# EAGLE schematic PROJECT_V2 (EAGLE 8.7.0)
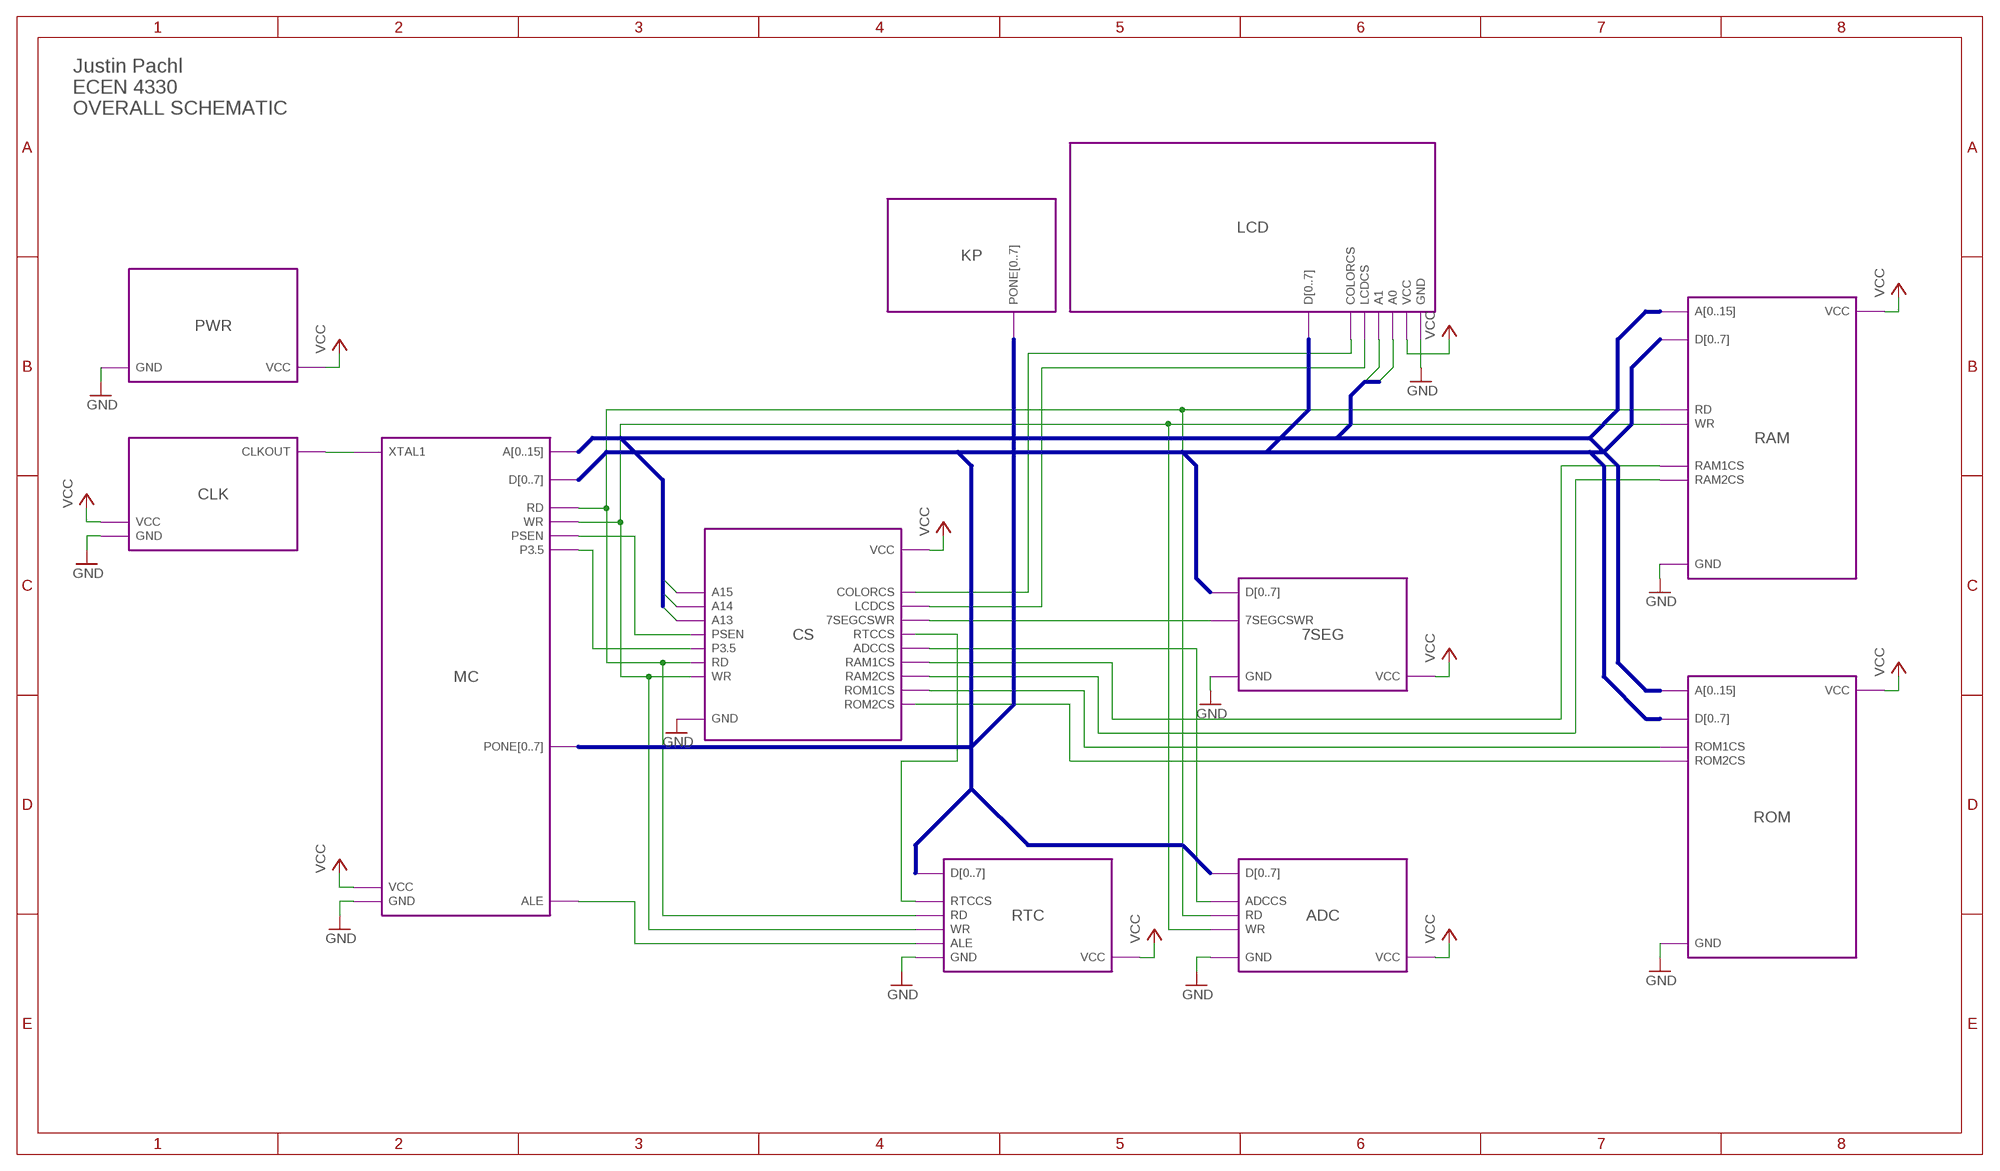
[diagram p0: schematic, sheet 1]

## Module instances
CLK = CLOCK
ROM = ROM
RAM = RAM
7SEG = 7SEG
PWR = POWERSP
LCD = LCD
RTC = RTC
ADC = ADC
MC = MICROCONTROLLER
CS = CHIPSELECT
KP = KEYPAD

## Nets
7SEGCSWR: port 7SEG.7SEGCSWR CS.7SEGCSWR
A0: port LCD.A0
A1: port LCD.A1
A13: port CS.A13
A14: port CS.A14
A15: port CS.A15
ADCCS: port CS.ADCCS ADC.ADCCS
ALE: port RTC.ALE MC.ALE
CLKSIG: port CLK.CLKOUT MC.XTAL1
COLORCS: port LCD.COLORCS CS.COLORCS
GND: port LCD.GND ROM.GND ADC.GND RTC.GND MC.GND CLK.GND PWR.GND 7SEG.GND RAM.GND CS.GND
LCDCS: port CS.LCDCS LCD.LCDCS
P3.5: port MC.P3.5 CS.P3.5
PSEN: port MC.PSEN CS.PSEN
RAM1CS: port CS.RAM1CS RAM.RAM1CS
RAM2CS: port CS.RAM2CS RAM.RAM2CS
RD: port MC.RD CS.RD RAM.RD ADC.RD RTC.RD
ROM1CS: port ROM.ROM1CS CS.ROM1CS
ROM2CS: port ROM.ROM2CS CS.ROM2CS
RTCCS: port RTC.RTCCS CS.RTCCS
VCC: port PWR.VCC RTC.VCC ADC.VCC ROM.VCC RAM.VCC LCD.VCC 7SEG.VCC MC.VCC CLK.VCC CS.VCC
WR: port MC.WR CS.WR RAM.WR ADC.WR RTC.WR

## Buses
A[0..15]
D[0..7]
PONE[0..7]

## Notes on the sheet
- Justin Pachl
  ECEN 4330
  OVERALL SCHEMATIC

## Library data of the parts

## Module CLOCK
Ports: GND(pwr) VCC(pwr) CLKOUT(io)
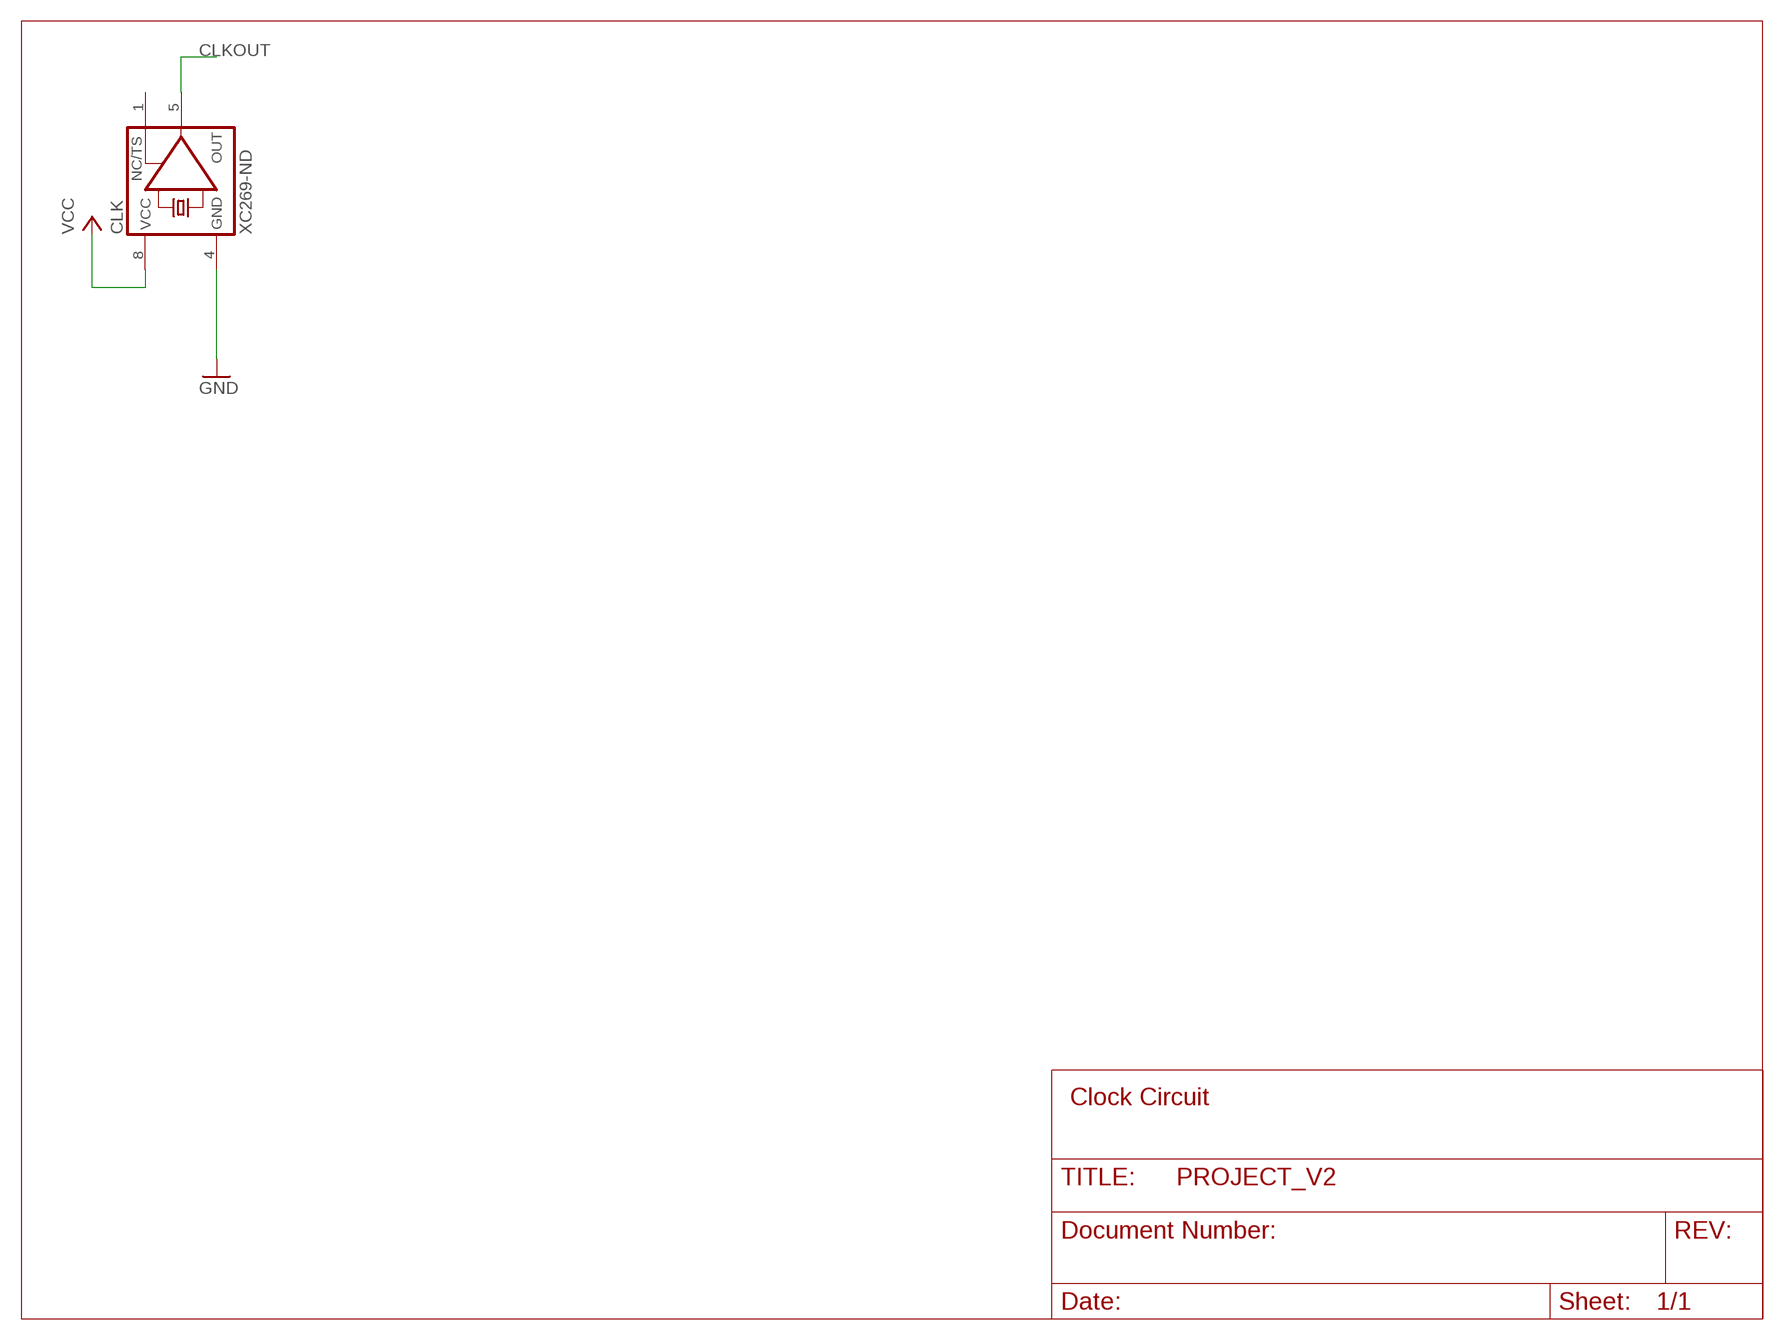
[diagram p1: schematic, module CLOCK, sheet 1]

### Parts
CLK  XC269-ND  XO-8  [DIL08S]

### Nets
CLKOUT: CLK.5(OUT)
GND: CLK.4(GND)
VCC: CLK.8(VCC)
Unconnected: CLK.1(TS)

### Notes on the sheet
- Clock Circuit

### Library data of the parts
CLK = crystal:XO-: CRYSTAL; OC_FARNELL: unknown; OC_NEWARK: unknown

## Module ROM
Ports: VCC(pwr) GND(pwr) A[0..15](io) D[0..7](io) ROM1CS(io) ROM2CS(io)
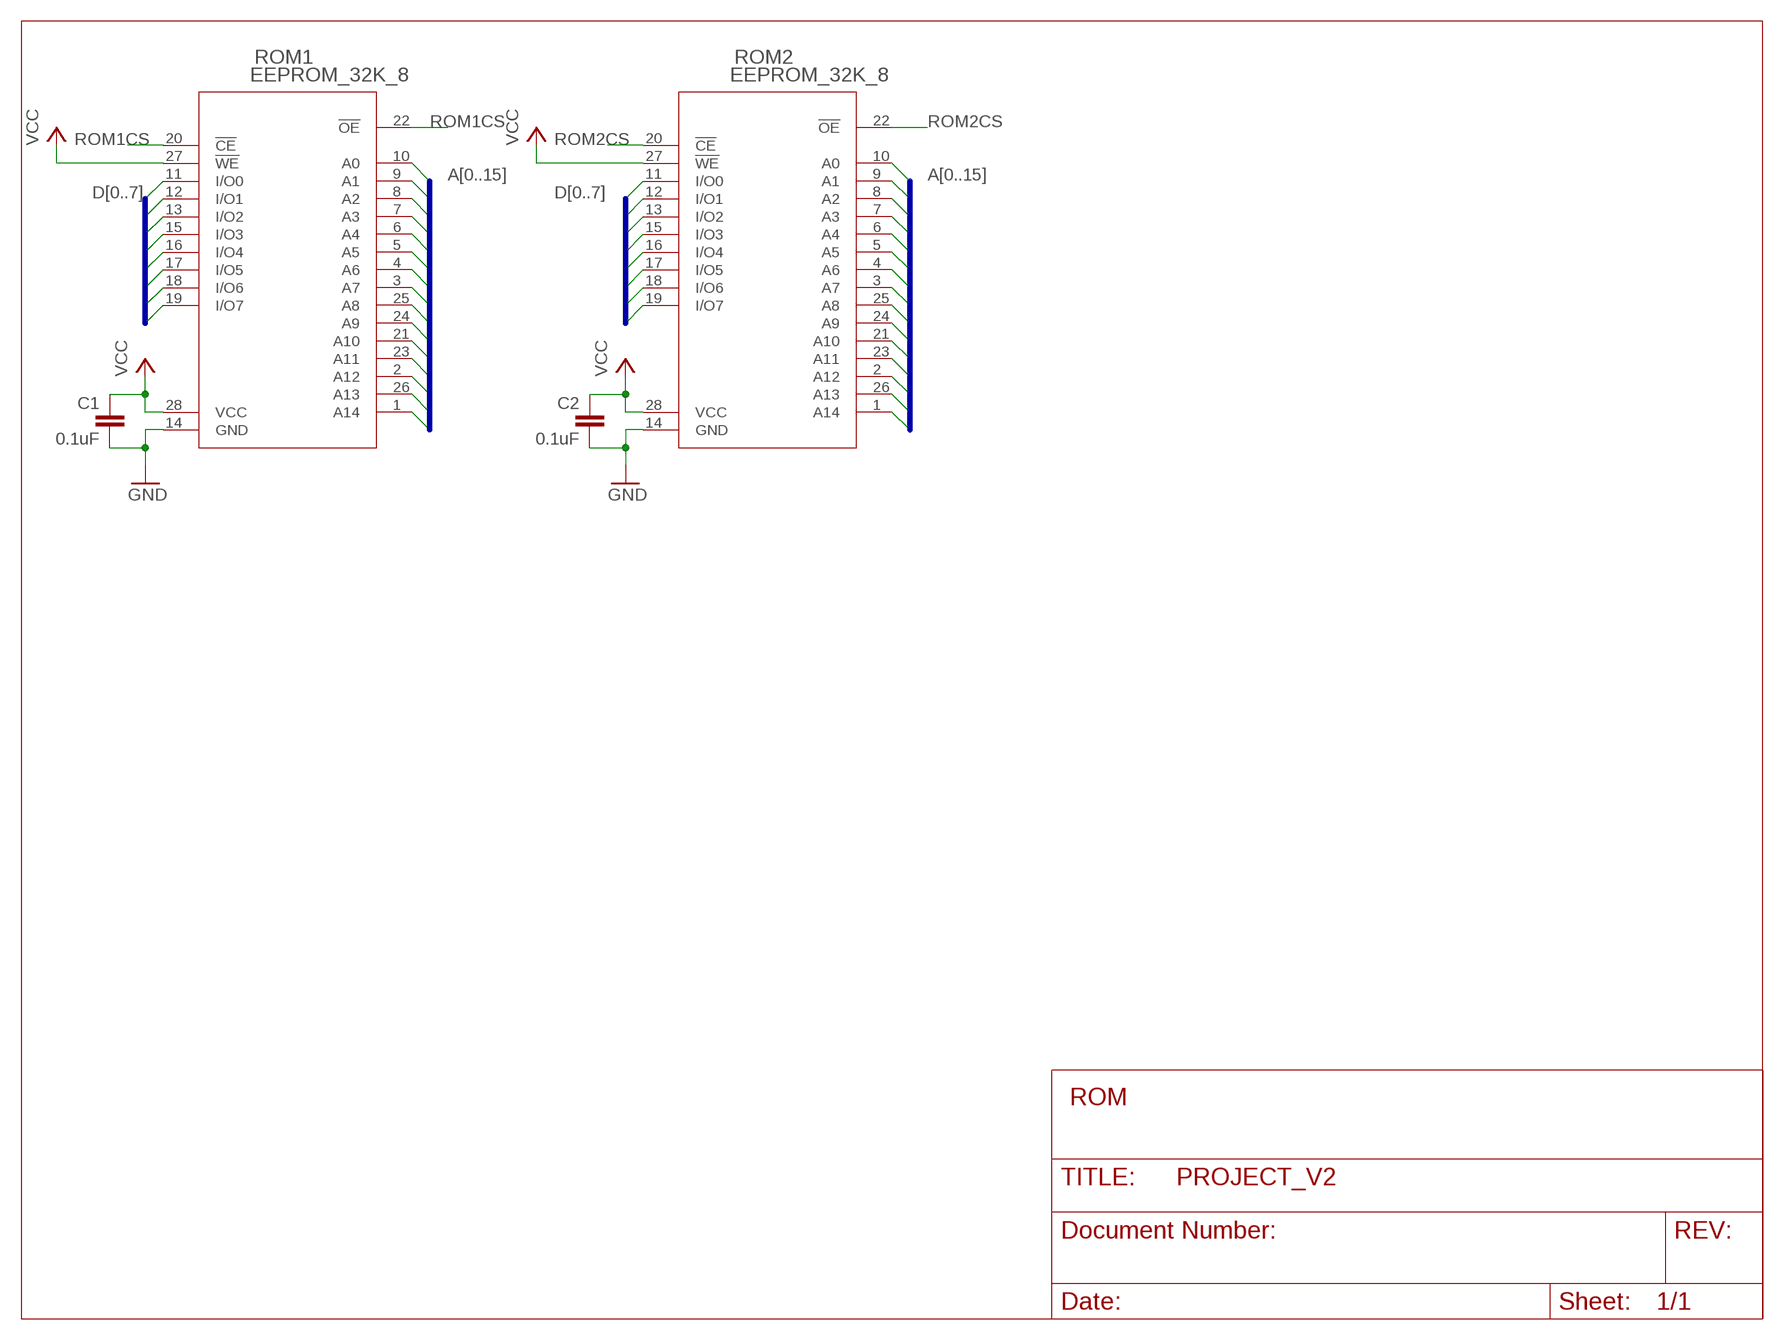
[diagram p2: schematic, module ROM, sheet 1]

### Parts
C1  0.1uF  0.1UF-KIT-EZ-50V-20%  [CAP-PTH-SMALL-KIT]
C2  0.1uF  0.1UF-KIT-EZ-50V-20%  [CAP-PTH-SMALL-KIT]
ROM1  EEPROM_32K_8  [28_P6]
ROM2  EEPROM_32K_8  [28_P6]

### Nets
A0: ROM1.10(A0) ROM2.10(A0)
A1: ROM1.9(A1) ROM2.9(A1)
A2: ROM1.8(A2) ROM2.8(A2)
A3: ROM1.7(A3) ROM2.7(A3)
A4: ROM1.6(A4) ROM2.6(A4)
A5: ROM1.5(A5) ROM2.5(A5)
A6: ROM1.4(A6) ROM2.4(A6)
A7: ROM1.3(A7) ROM2.3(A7)
A8: ROM1.25(A8) ROM2.25(A8)
A9: ROM1.24(A9) ROM2.24(A9)
A10: ROM1.21(A10) ROM2.21(A10)
A11: ROM1.23(A11) ROM2.23(A11)
A12: ROM1.2(A12) ROM2.2(A12)
A13: ROM1.26(A13) ROM2.26(A13)
A14: ROM1.1(A14) ROM2.1(A14)
D0: ROM1.11(I/O0) ROM2.11(I/O0)
D1: ROM1.12(I/O1) ROM2.12(I/O1)
D2: ROM1.13(I/O2) ROM2.13(I/O2)
D3: ROM1.15(I/O3) ROM2.15(I/O3)
D4: ROM1.16(I/O4) ROM2.16(I/O4)
D5: ROM1.17(I/O5) ROM2.17(I/O5)
D6: ROM1.18(I/O6) ROM2.18(I/O6)
D7: ROM1.19(I/O7) ROM2.19(I/O7)
GND: C1.2 C2.2 ROM1.14(GND) ROM2.14(GND)
ROM1CS: ROM1.20(!CE) ROM1.22(!OE)
ROM2CS: ROM2.20(!CE) ROM2.22(!OE)
VCC: C1.1 C2.1 ROM1.27(!WE) ROM1.28(VCC) ROM2.27(!WE) ROM2.28(VCC)

### Buses
D[0..7]
A[0..15]

### Notes on the sheet
- ROM

### Library data of the parts
C1 C2 = Fuckboiz:0.1UF: 0.1µF ceramic capacitors A capacitor is a passive two-terminal electrical component used to store electrical energy temporarily in an electric field.; PROD_ID: CAP-08370
ROM1 ROM2 = Fuckboiz:EEPROM_32K_8: 32k x 8bit ROM Jeremiah Ohlman

## Module RAM
Ports: GND(pwr) VCC(pwr) A[0..15](io) D[0..7](io) RAM1CS(io) RAM2CS(io) RD(io) WR(io)
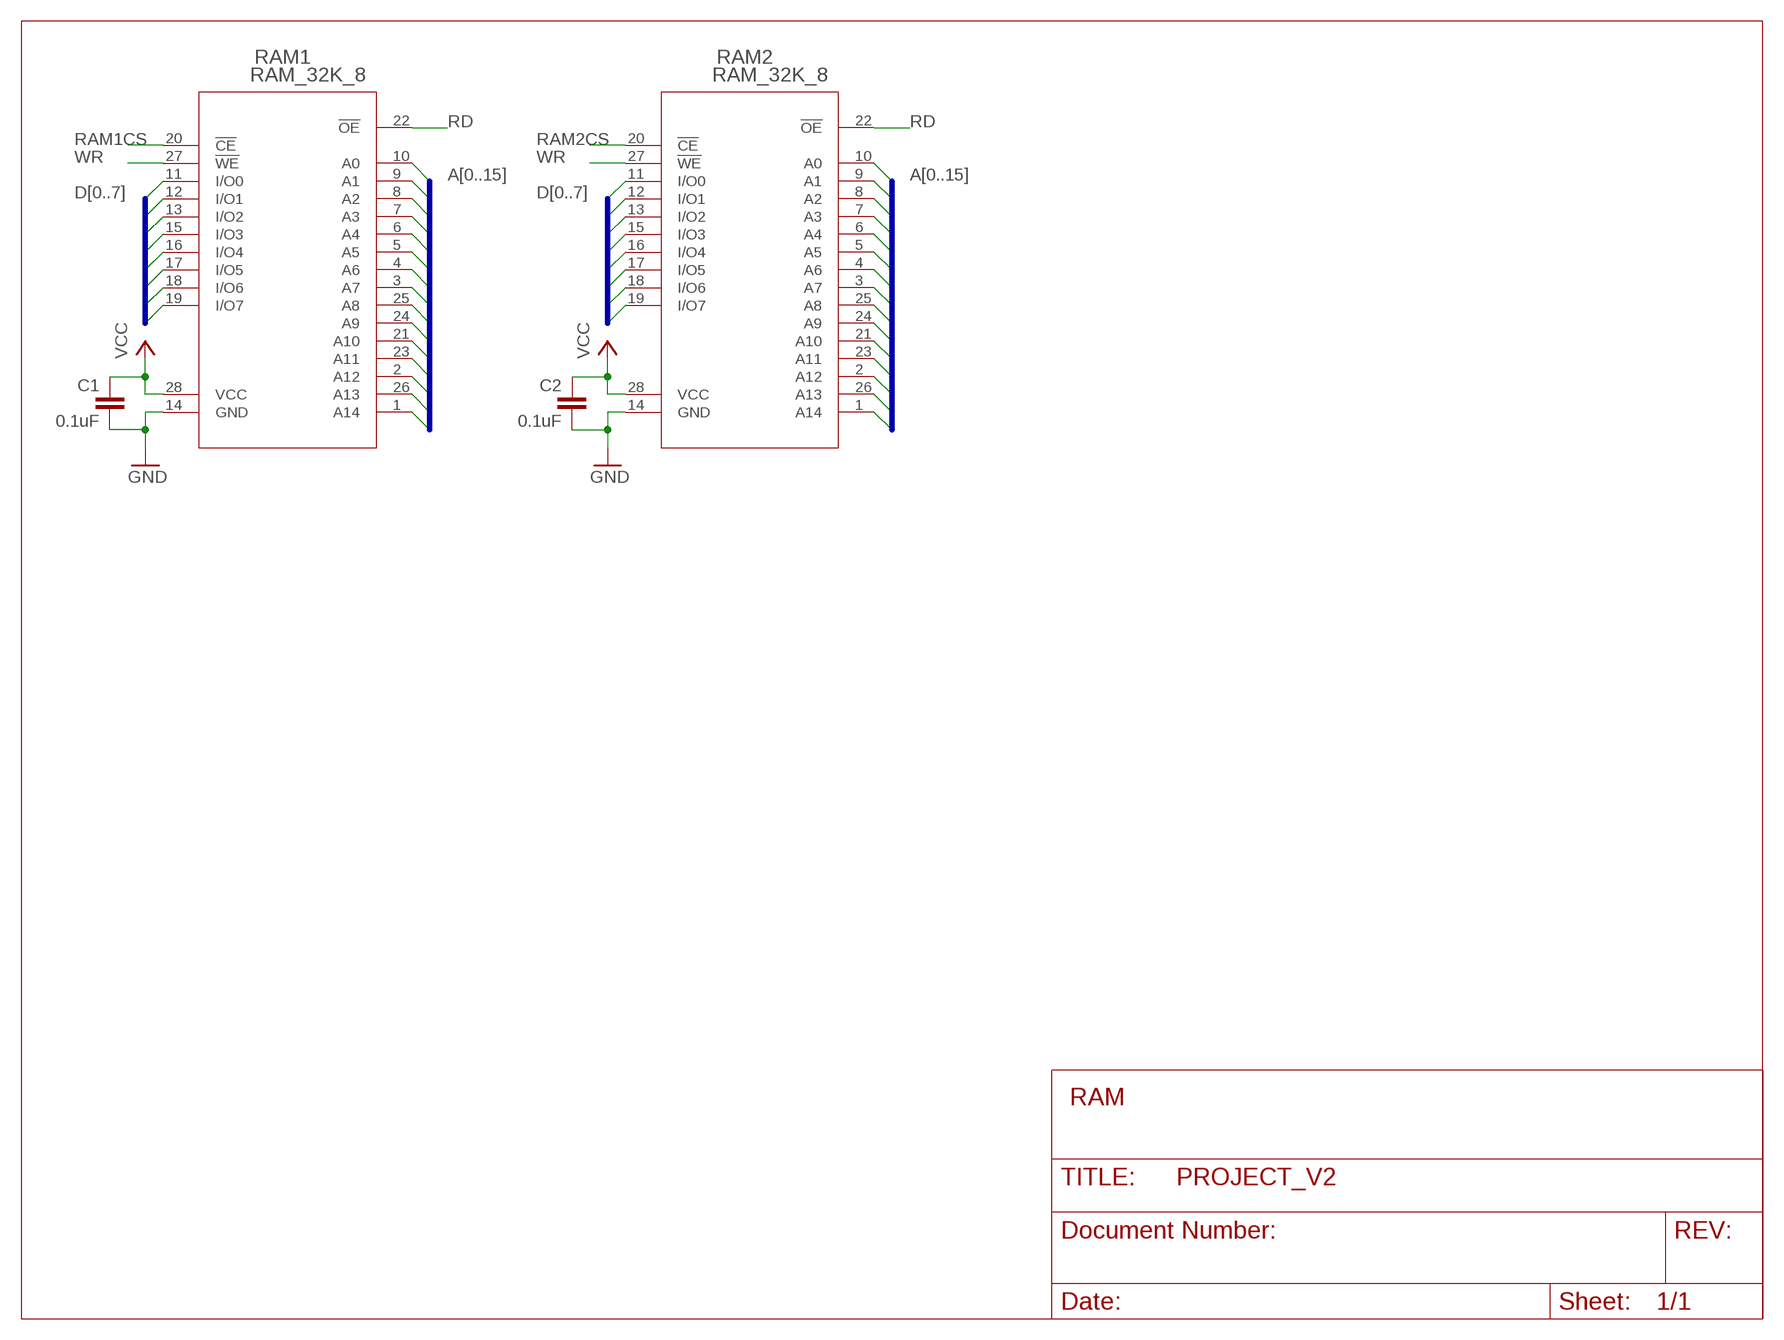
[diagram p3: schematic, module RAM, sheet 1]

### Parts
C1  0.1uF  0.1UF-KIT-EZ-50V-20%  [CAP-PTH-SMALL-KIT]
C2  0.1uF  0.1UF-KIT-EZ-50V-20%  [CAP-PTH-SMALL-KIT]
RAM1  RAM_32K_8  [28P6]
RAM2  RAM_32K_8  [28P6]

### Nets
A0: RAM1.10(A0) RAM2.10(A0)
A1: RAM1.9(A1) RAM2.9(A1)
A2: RAM1.8(A2) RAM2.8(A2)
A3: RAM1.7(A3) RAM2.7(A3)
A4: RAM1.6(A4) RAM2.6(A4)
A5: RAM1.5(A5) RAM2.5(A5)
A6: RAM1.4(A6) RAM2.4(A6)
A7: RAM1.3(A7) RAM2.3(A7)
A8: RAM1.25(A8) RAM2.25(A8)
A9: RAM1.24(A9) RAM2.24(A9)
A10: RAM1.21(A10) RAM2.21(A10)
A11: RAM1.23(A11) RAM2.23(A11)
A12: RAM1.2(A12) RAM2.2(A12)
A13: RAM1.26(A13) RAM2.26(A13)
A14: RAM1.1(A14) RAM2.1(A14)
D0: RAM1.11(I/O0) RAM2.11(I/O0)
D1: RAM1.12(I/O1) RAM2.12(I/O1)
D2: RAM1.13(I/O2) RAM2.13(I/O2)
D3: RAM1.15(I/O3) RAM2.15(I/O3)
D4: RAM1.16(I/O4) RAM2.16(I/O4)
D5: RAM1.17(I/O5) RAM2.17(I/O5)
D6: RAM1.18(I/O6) RAM2.18(I/O6)
D7: RAM1.19(I/O7) RAM2.19(I/O7)
GND: C1.2 C2.2 RAM1.14(GND) RAM2.14(GND)
RAM1CS: RAM1.20(!CE)
RAM2CS: RAM2.20(!CE)
RD: RAM1.22(!OE) RAM2.22(!OE)
VCC: C1.1 C2.1 RAM1.28(VCC) RAM2.28(VCC)
WR: RAM1.27(!WE) RAM2.27(!WE)

### Buses
D[0..7]
A[0..15]

### Notes on the sheet
- RAM

### Library data of the parts
C1 C2 = Fuckboiz:0.1UF: 0.1µF ceramic capacitors A capacitor is a passive two-terminal electrical component used to store electrical energy temporarily in an electric field.; PROD_ID: CAP-08370
RAM1 RAM2 = Fuckboiz:RAM_32K_8: 32k x 8bit RAM Jeremiah Ohlman

## Module 7SEG
Ports: GND(pwr) VCC(pwr) D[0..7](io) 7SEGCSWR(io)
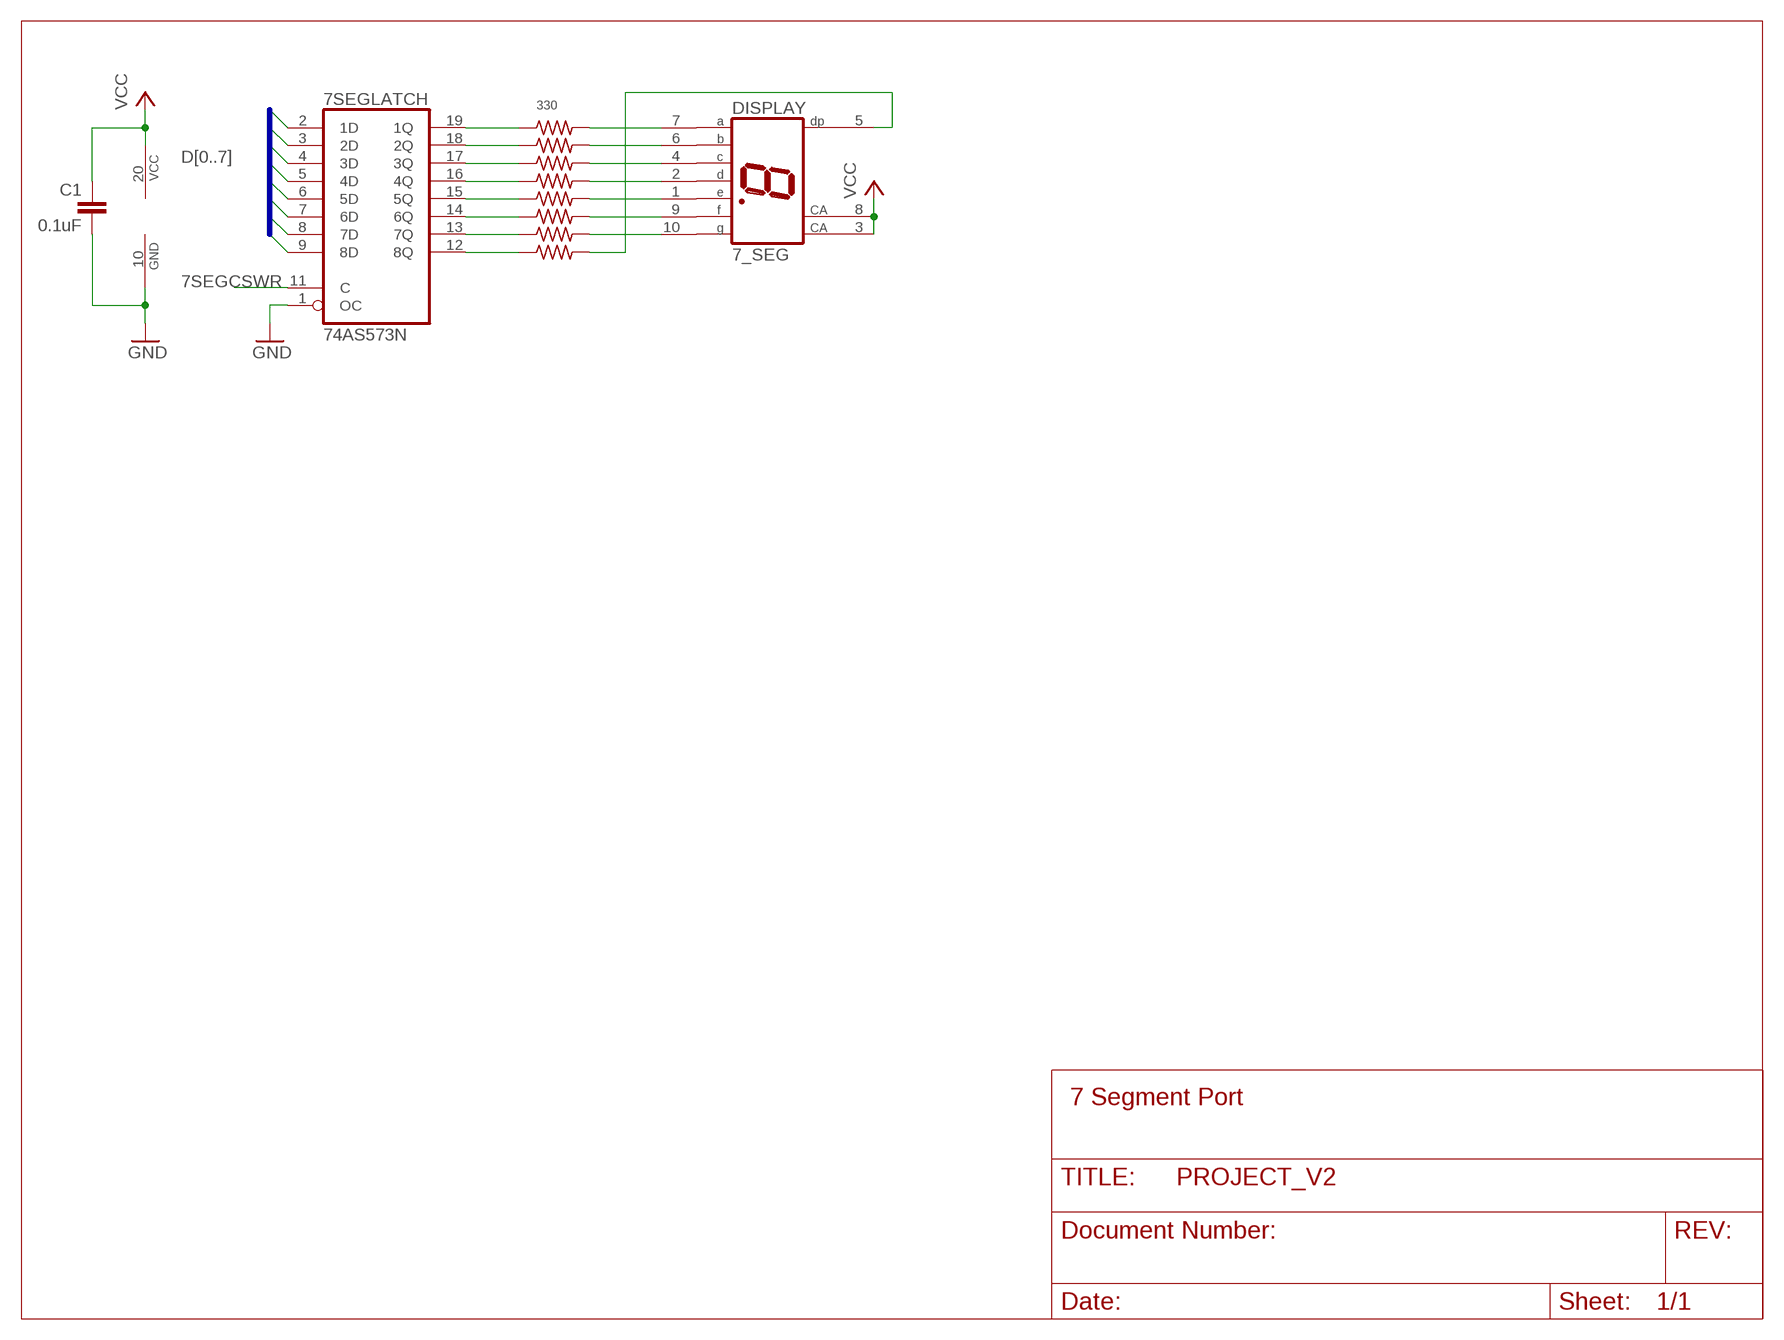
[diagram p4: schematic, module 7SEG, sheet 1]

### Parts
7SEGLATCH  74AS573N  [DIL20]
C1  0.1uF  0.1UF-KIT-EZ-50V-20%  [CAP-PTH-SMALL-KIT]
DISPLAY  7_SEG  [754-1460-5-ND]
R2  330  R-US_0204/7  [0204/7]
R3  330  R-US_0204/7  [0204/7]
R4  330  R-US_0204/7  [0204/7]
R5  330  R-US_0204/7  [0204/7]
R6  330  R-US_0204/7  [0204/7]
R7  330  R-US_0204/7  [0204/7]
R8  330  R-US_0204/7  [0204/7]
R9  330  R-US_0204/7  [0204/7]

### Nets
7SEGCSWR: 7SEGLATCH.11(C)
D0: 7SEGLATCH.2(1D)
D1: 7SEGLATCH.3(2D)
D2: 7SEGLATCH.4(3D)
D3: 7SEGLATCH.5(4D)
D4: 7SEGLATCH.6(5D)
D5: 7SEGLATCH.7(6D)
D6: 7SEGLATCH.8(7D)
D7: 7SEGLATCH.9(8D)
GND: 7SEGLATCH.1(OC) 7SEGLATCH.10(GND) C1.2
N$3: 7SEGLATCH.19(1Q) R2.1
N$4: 7SEGLATCH.18(2Q) R3.1
N$5: 7SEGLATCH.17(3Q) R4.1
N$6: 7SEGLATCH.16(4Q) R5.1
N$7: 7SEGLATCH.15(5Q) R6.1
N$8: 7SEGLATCH.14(6Q) R7.1
N$9: 7SEGLATCH.13(7Q) R8.1
N$10: DISPLAY.10(G) R8.2
N$11: DISPLAY.9(F) R7.2
N$12: DISPLAY.1(E) R6.2
N$13: DISPLAY.2(D) R5.2
N$14: DISPLAY.4(C) R4.2
N$33: DISPLAY.6(B) R3.2
N$43: DISPLAY.7(A) R2.2
N$44: DISPLAY.5(DP) R9.2
N$45: 7SEGLATCH.12(8Q) R9.1
VCC: 7SEGLATCH.20(VCC) C1.1 DISPLAY.3(CA) DISPLAY.8(CA)

### Buses
D[0..7]

### Notes on the sheet
- 330
- 7 Segment Port

### Library data of the parts
7SEGLATCH = Fuckboiz:74*573: 8-bit D latch BUS DRIVER
C1 = Fuckboiz:0.1UF: 0.1µF ceramic capacitors A capacitor is a passive two-terminal electrical component used to store electrical energy temporarily in an electric field.; PROD_ID: CAP-08370
DISPLAY = Fuckboiz:7_SEG: LED DISPLAY 1-character 7 segment, decimal point right; OC_FARNELL: unknown; OC_NEWARK: unknown
R2-R9 = adafruit:R-US_: RESISTOR, American symbol

## Module POWERSP
Ports: VCC(pwr) GND(pwr)
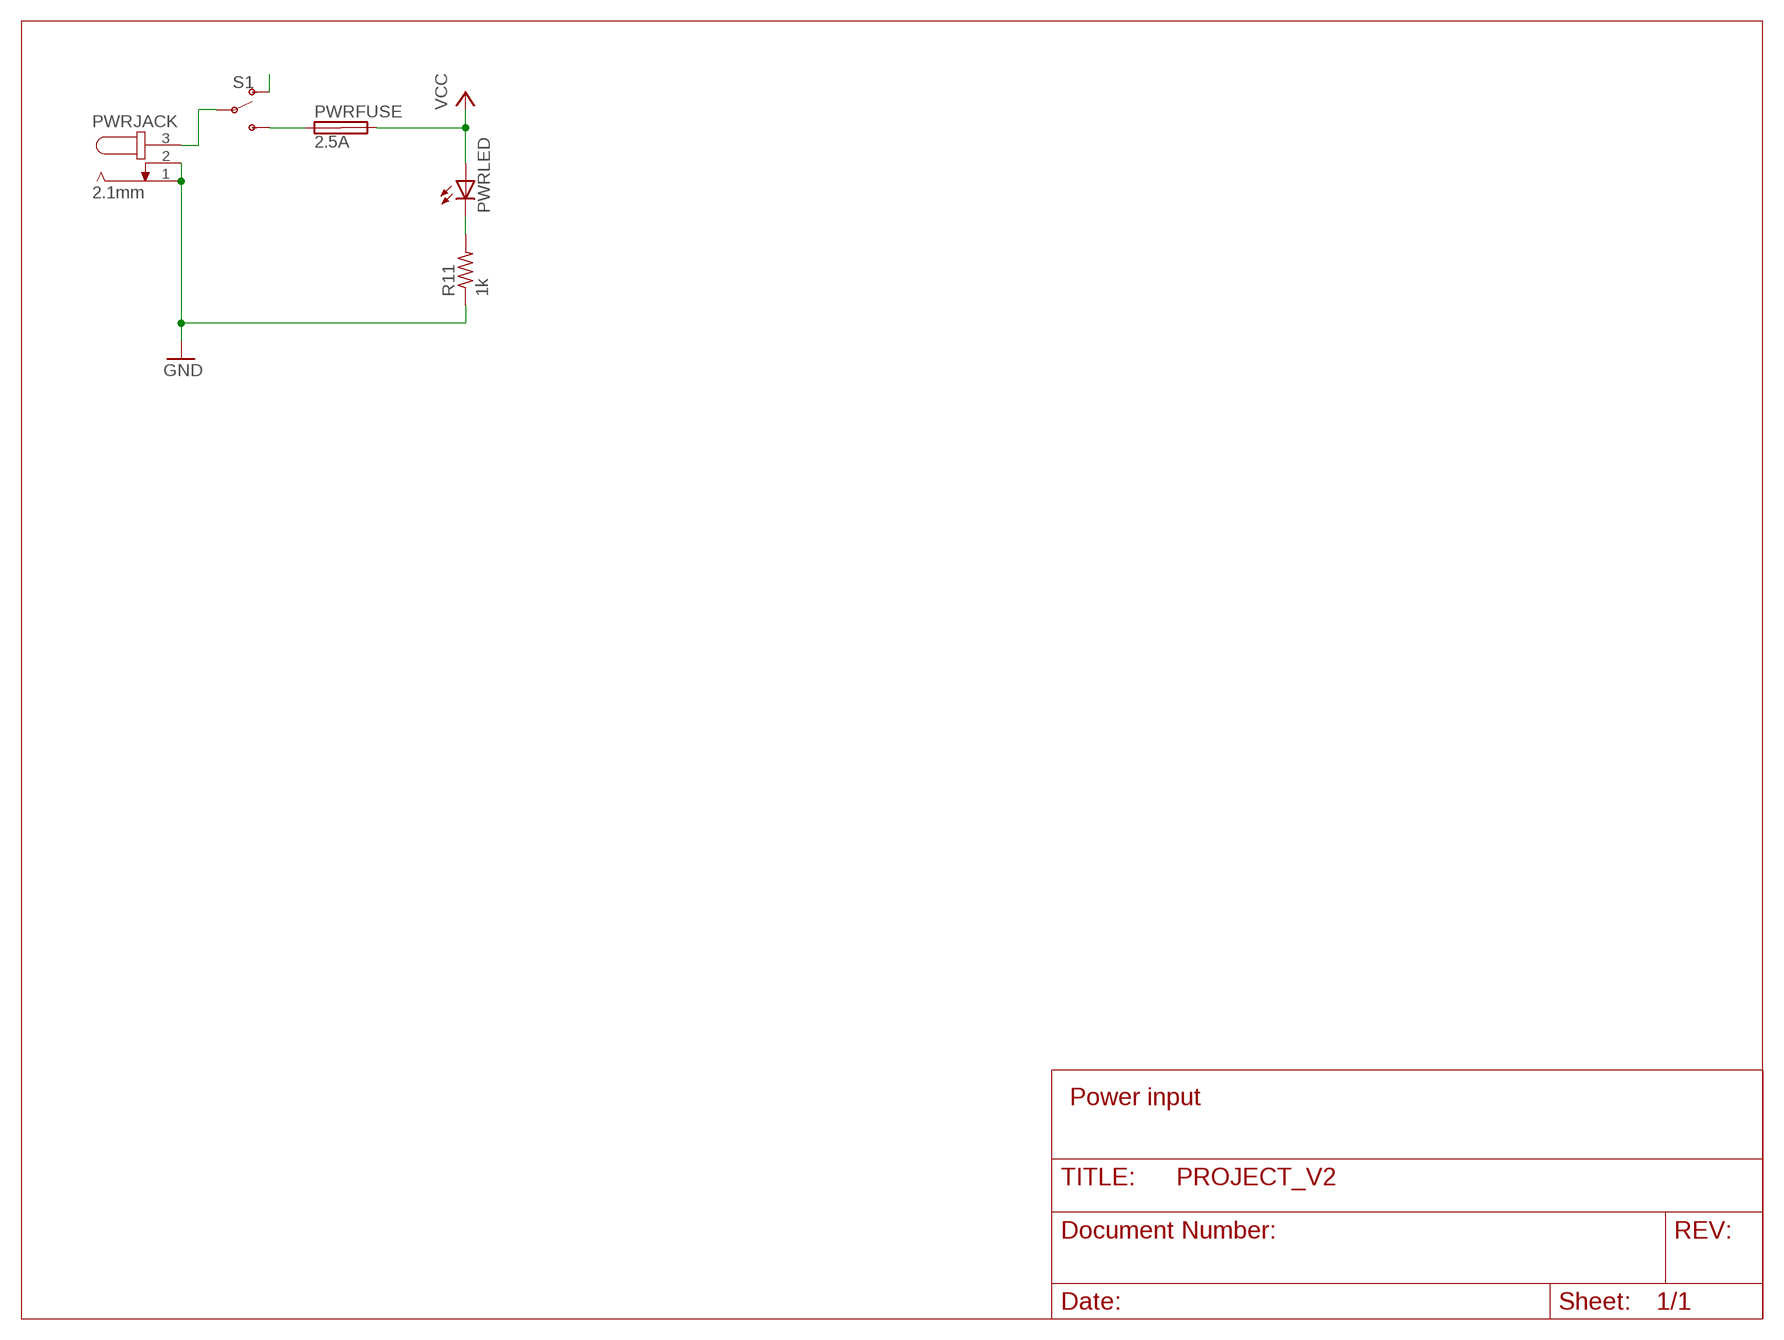
[diagram p5: schematic, module POWERSP, sheet 1]

### Parts
PWRFUSE  2.5A  FUSE  [SHK20Q]
PWRJACK  2.1mm  JACK-PLUG0  [SPC4077]
PWRLED  LED5MM  [LED5MM]
R11  1k  R-US_0204/7  [0204/7]
S1  SPDT_SWITCH-PTH-11.6X4.0MM-LOCK  [SPDT_EG2355-ND]

### Nets
GND: PWRJACK.1 PWRJACK.2 R11.1
N$2: PWRFUSE.1A S1.3(S)
N$30: S1.1(O)
N$48: PWRJACK.3 S1.2(P)
N$49: PWRLED.K(C) R11.2
VCC: PWRFUSE.2A PWRLED.A
Unconnected: PWRFUSE.1B PWRFUSE.2B

### Notes on the sheet
- Power input

### Library data of the parts
PWRFUSE = Fuckboiz:FUSE: FUSE HOLDER 5 x 20 mm, SH contact, E1207 Buerklin 64G6061; OC_FARNELL: unknown; OC_NEWARK: unknown
PWRJACK = Fuckboiz:JACK-PLUG: DC POWER JACK Power Jack, DC, Right Angle, Through Hole, Rated 5A at 16VDC, PC Terminals Distributor: Farnell (www.Farnell.de) Drawing: 84N1161.pdf / 84N1162.pdf Manufacturer: SPC Technology (www.spctechnology.com) Type: SPC4077 / SPC 4078; OC_FARNELL: unknown; OC_NEWARK: unknown
PWRLED = adafruit:LED: LED OSRAM: - CHIPLED LG R971, LG N971, LY N971, LG Q971, LY Q971, LO R971, LY R971 LH N974, LH R974 LS Q976, LO Q976, LY Q976 LO Q996 - Hyper CHIPLED LW Q18S LB Q993, LB Q99A, LB R99A - SideLED LS A670, LO A670, LY A670, LG A670, LP A670 LB A673, LV A673, LT A673, LW A673 LH A674 LY A675 LS A676, LA A676, LO A676, LY A676, LW A676 LS A679, LY A679, LG A679 - Hyper Micro SIDELED® LS Y876, LA Y876, LO Y876, LY Y876 LT Y87S - SmartLED LW L88C, LW L88S LB L89C, LB L89S, LG L890 LS L89K, LO L89K, LY L89K LS L896, LA L896, LO L896, LY L896 - TOPLED LS T670, LO T670, LY T670, LG T670, LP T670 LSG T670, LSP T670, LSY T670, LOP T670, LYG T670 LG T671, LOG T671, LSG T671 LB T673, LV T673, LT T673, LW T673 LH T674 LS T676, LA T676, LO T676, LY T676, LB T676, LH T676, LSB T676, LW T676 LB T67C, LV T67C, LT T67C, LS T67K, LO T67K, LY T67K, LW E67C LS E67B, LA E67B, LO E67B, LY E67B, LB E67C, LV E67C, LT E67C LW T67C LS T679, LY T679, LG T679 LS T770, LO T770, LY T770, LG T770, LP T770 LB T773, LV T773, LT T773, LW T773 LH T774 LS E675, LA E675, LY E675, LS T675 LS T776, LA T776, LO T776, LY T776, LB T776 LHGB T686 LT T68C, LB T68C - Hyper Mini TOPLED® LB M676 - Mini TOPLED Santana® LG M470 LS M47K, LO M47K, LY M47K Source: http://www.osram.convergy.de/
R11 = resistor:R-US_: RESISTOR, American symbol
S1 = Fuckboiz:SPDT_SWITCH: Single Pole, Double Throw (SPDT) Switch Single-pole, double-throw (SPDT) switch. Variant Overview SMD-AYZ0202 Surface Mount DPDT Switch <https://www.sparkfun.com/products/597> (COM-00597) Used on e.g. LilyPad Arduino USB - ATmega32U4 Board <https://www.sparkfun.com/products/12049> PTH-11.6X4.0MM SPDT Mini Power Switch <https://www.sparkfun.com/products/102> (COM-00102) Used on e.g. SparkFun Simon Says - Through-Hole Soldering Kit <https://www.sparkfun.com/products/10547> (KIT-10547) PTH-11.6X4.0MM-KIT KIT version of SPDT Mini Power Switch - Simplifies soldering by removing tStop of switch pins - only one side can be soldered. PTH-11.6X4.0MM-LOCK LOCK version of SPDT Mini Power Switch - Offset pins hold switch in place for easier soldering. SMD-RIGHT-ANGLE Surface Mount Right Angle Switch <https://www.sparkfun.com/products/10860> (COM-10860) Used on e.g. SparkFun ESP8266 Thing <https://www.sparkfun.com/products/13231> Alex Part Jeremiah Part Karl Part Justin Part; PROD_ID: SWCH-08261; SF_SKU: COM-00102

## Module LCD
Ports: GND(pwr) VCC(pwr) A0(io) A1(io) LCDCS(io) COLORCS(io) D[0..7](io)
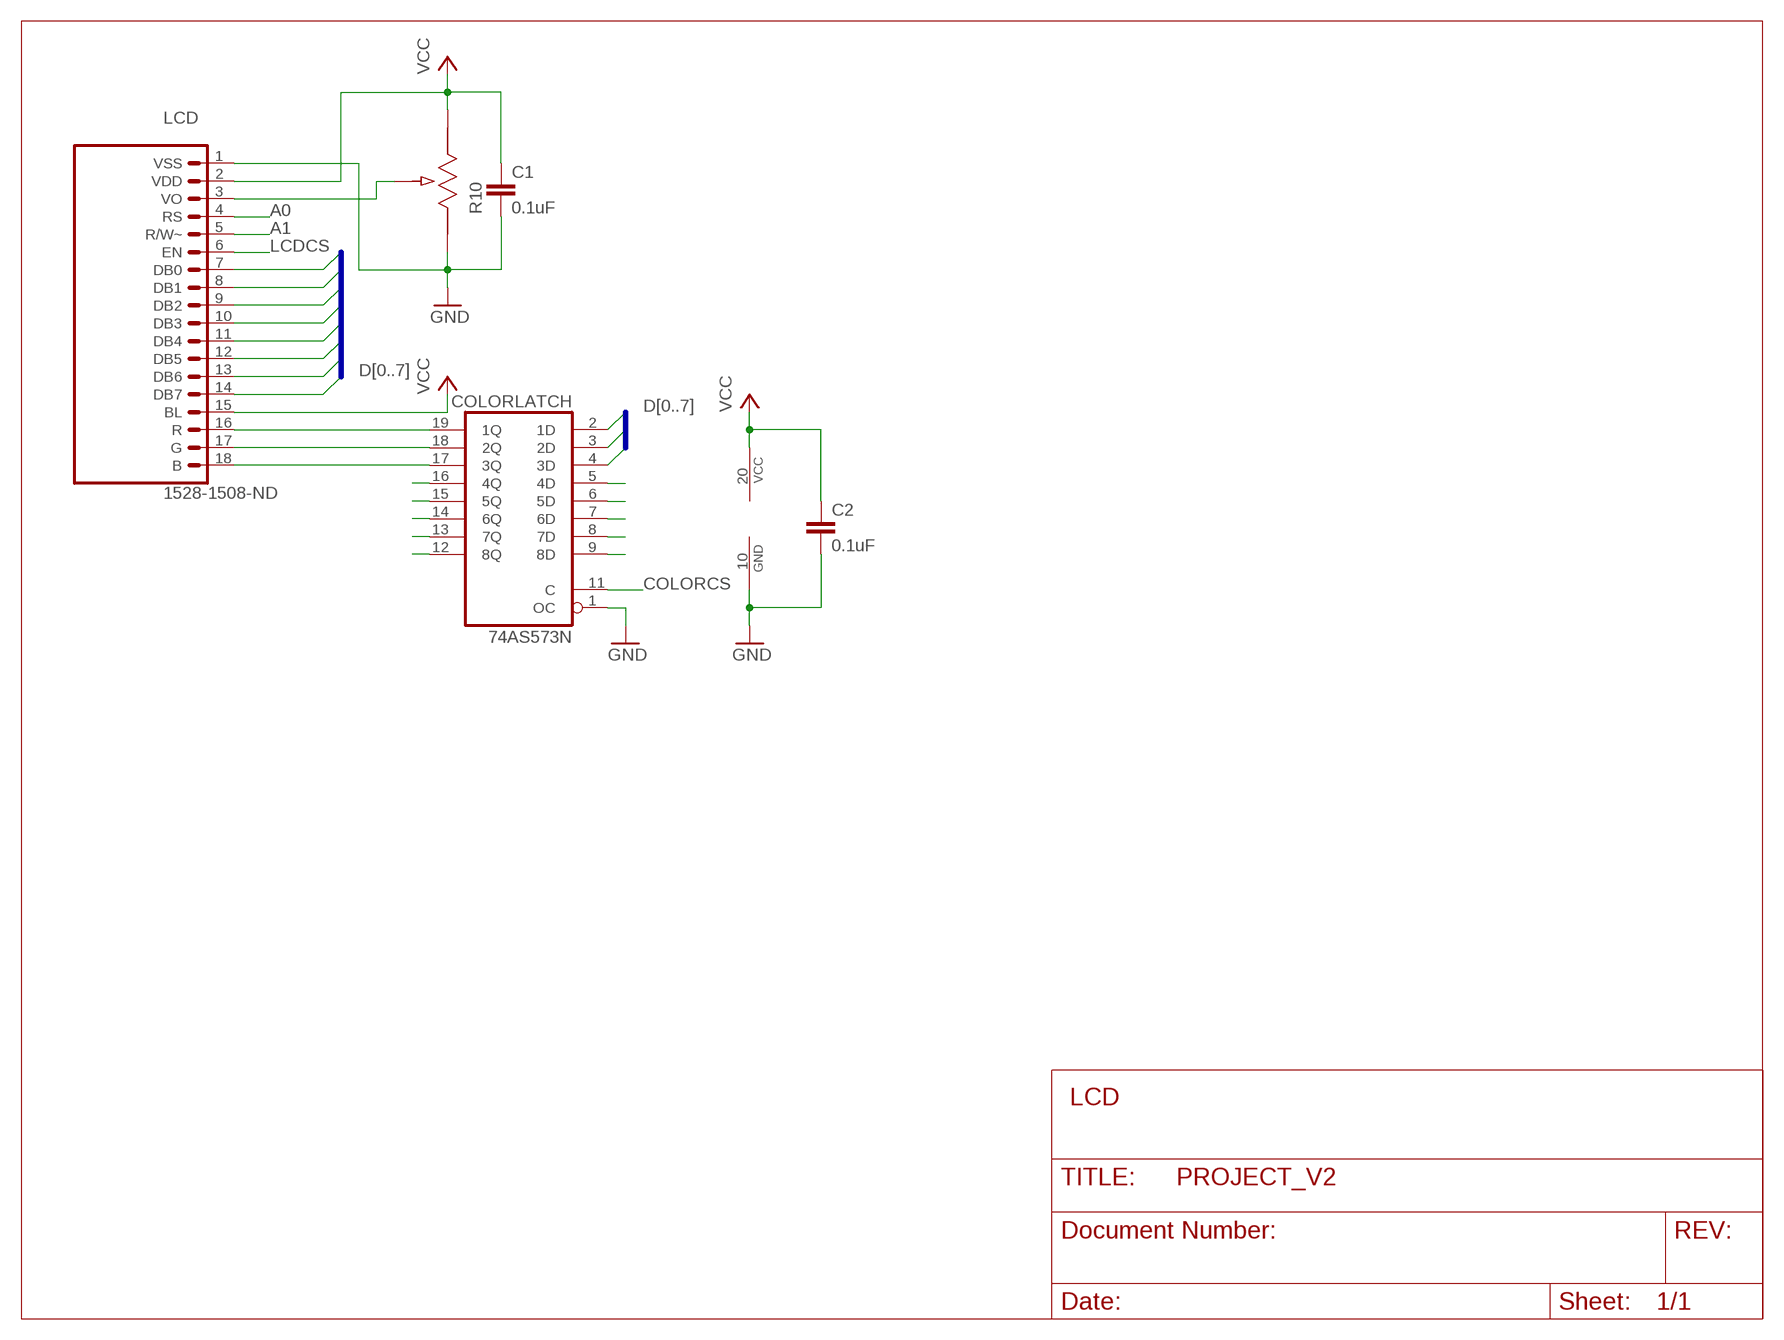
[diagram p6: schematic, module LCD, sheet 1]

### Parts
C1  0.1uF  0.1UF-KIT-EZ-50V-20%  [CAP-PTH-SMALL-KIT]
C2  0.1uF  0.1UF-KIT-EZ-50V-20%  [CAP-PTH-SMALL-KIT]
COLORLATCH  74AS573N  [DIL20]
LCD  1528-1508-ND  LCD  [1X18]
R10  3362P-1-103LF_POT  [POT_3362P]

### Nets
A0: LCD.4(RS)
A1: LCD.5(R/W~)
COLORCS: COLORLATCH.11(C)
D0: COLORLATCH.2(1D) LCD.7(DB0)
D1: COLORLATCH.3(2D) LCD.8(DB1)
D2: COLORLATCH.4(3D) LCD.9(DB2)
D3: LCD.10(DB3)
D4: LCD.11(DB4)
D5: LCD.12(DB5)
D6: LCD.13(DB6)
D7: LCD.14(DB7)
GND: C1.2 C2.2 COLORLATCH.1(OC) COLORLATCH.10(GND) LCD.1(VSS) R10.1
LCDCS: LCD.6(EN)
N$16: LCD.3(VO) R10.2
N$17: COLORLATCH.19(1Q) LCD.16(R)
N$23: COLORLATCH.18(2Q) LCD.17(G)
N$24: COLORLATCH.17(3Q) LCD.18(B)
N$32: COLORLATCH.5(4D)
N$34: COLORLATCH.6(5D)
N$36: COLORLATCH.7(6D)
N$37: COLORLATCH.8(7D)
N$38: COLORLATCH.9(8D)
N$39: COLORLATCH.16(4Q)
N$40: COLORLATCH.15(5Q)
N$41: COLORLATCH.14(6Q)
N$42: COLORLATCH.13(7Q)
N$46: COLORLATCH.12(8Q)
VCC: C1.1 C2.1 COLORLATCH.20(VCC) LCD.2(VDD) LCD.15(BL) R10.3

### Buses
D[0..7]

### Notes on the sheet
- LCD

### Library data of the parts
C1 C2 = Fuckboiz:0.1UF: 0.1µF ceramic capacitors A capacitor is a passive two-terminal electrical component used to store electrical energy temporarily in an electric field.; PROD_ID: CAP-08370
COLORLATCH = Fuckboiz:74*573: 8-bit D latch BUS DRIVER
LCD = Fuckboiz:LCD: Multi connection point. Often used as Generic Header-pin footprint for 0.1 inch spaced/style header connections On any of the 0.1 inch spaced packages, you can populate with these: Break Away Headers - Straight <https://www.sparkfun.com/products/116> (PRT-00116) Break Away Male Headers - Right Angle <https://www.sparkfun.com/products/553> (PRT-00553) Female Headers <https://www.sparkfun.com/products/115> (PRT-00115) Break Away Headers - Machine Pin <https://www.sparkfun.com/products/117> (PRT-00117) Break Away Female Headers - Swiss Machine Pin <https://www.sparkfun.com/products/743> (PRT-00743) For SCREWTERMINALS and SPRING TERMINALS visit here: Screw Terimnals on SparkFun.com <https://www.sparkfun.com/search/results?term=Screw+Terminals> (5mm/3.5mm/2.54mm spacing) This device is also useful as a general connection point to wire up your design to another part of your project. Our various solder wires solder well into these plated through hole pads. Hook-Up Wire - Assortment (Stranded, 22 AWG) <https://www.sparkfun.com/products/11375> (PRT-11375) Hook-Up Wire - Assortment (Solid Core, 22 AWG) <https://www.sparkfun.com/products/11367> (PRT-11367) View the entire wire category on our website here <https://www.sparkfun.com/categories/141> Special notes: Molex polarized connector foot print use with SKU : PRT-08231 with associated crimp pins and housings. 1MM SMD Version SKU: PRT-10208 NOTES ON THE VARIANTS LOCK and LOCK_LONGPADS... This footprint was designed to help hold the alignment of a through-hole component (i.e. 6-pin header) while soldering it into place. You may notice that each hole has been shifted either up or down by 0.005 of an inch from it's more standard position (which is a perfectly straight line). This slight alteration caused the pins (the squares in the middle) to touch the edges of the holes. Because they are alternating, it causes a "brace" to hold the component in place. 0.005 has proven to be the perfect amount of "off-center" position when using our standard breakaway headers. Although looks a little odd when you look at the bare footprint, once you have a header in there, the alteration is very hard to notice. Also,if you push a header all the way into place, it is covered up entirely on the bottom side.
R10 = Fuckboiz:3362P-1-103LF_POT: Potentiometer Jeremiah Ohlman; MANUFACTURER_PART_NUMBER: 3362P1103LF; VENDOR: Bourns Electronics

## Module RTC
Ports: D[0..7](io) GND(pwr) VCC(pwr) RD(io) WR(io) RTCCS(io) ALE(io)
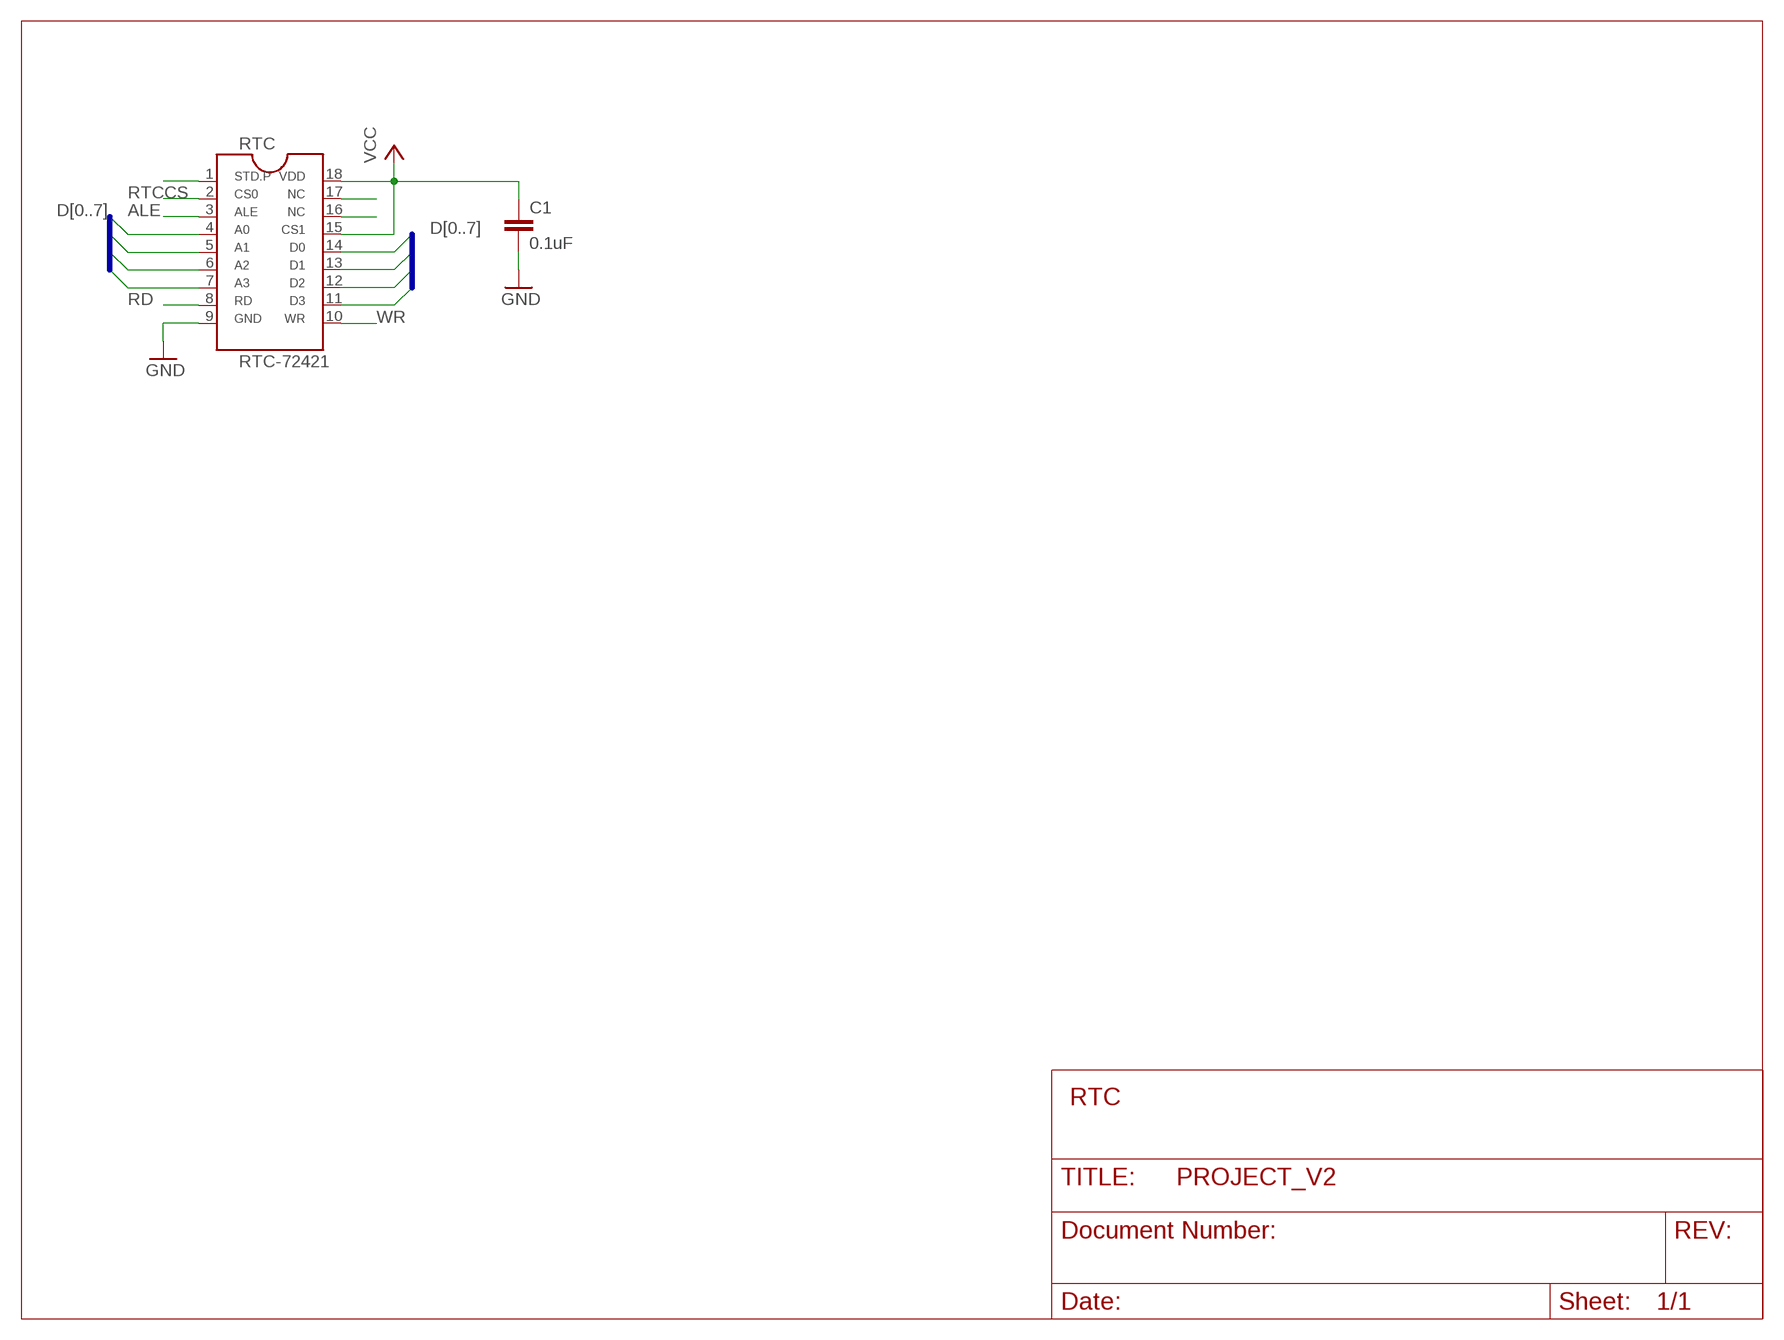
[diagram p7: schematic, module RTC, sheet 1]

### Parts
C1  0.1uF  0.1UF-KIT-EZ-50V-20%  [CAP-PTH-SMALL-KIT]
RTC  RTC-72421  [DIL18]

### Nets
ALE: RTC.3
D0: RTC.4 RTC.14
D1: RTC.5 RTC.13
D2: RTC.6 RTC.12
D3: RTC.7 RTC.11
GND: C1.2 RTC.9
N$1: RTC.1
N$25: RTC.16
N$29: RTC.17
RD: RTC.8
RTCCS: RTC.2
VCC: C1.1 RTC.15 RTC.18
WR: RTC.10

### Buses
D[0..7]

### Notes on the sheet
- RTC

### Library data of the parts
C1 = Fuckboiz:0.1UF: 0.1µF ceramic capacitors A capacitor is a passive two-terminal electrical component used to store electrical energy temporarily in an electric field.; PROD_ID: CAP-08370
RTC = Fuckboiz:RTC-72421: RTC-72421 SER3231-ND Jeremiah Ohlman

## Module ADC
Ports: GND(pwr) VCC(pwr) D[0..7](io) RD(io) WR(io) ADCCS(io)
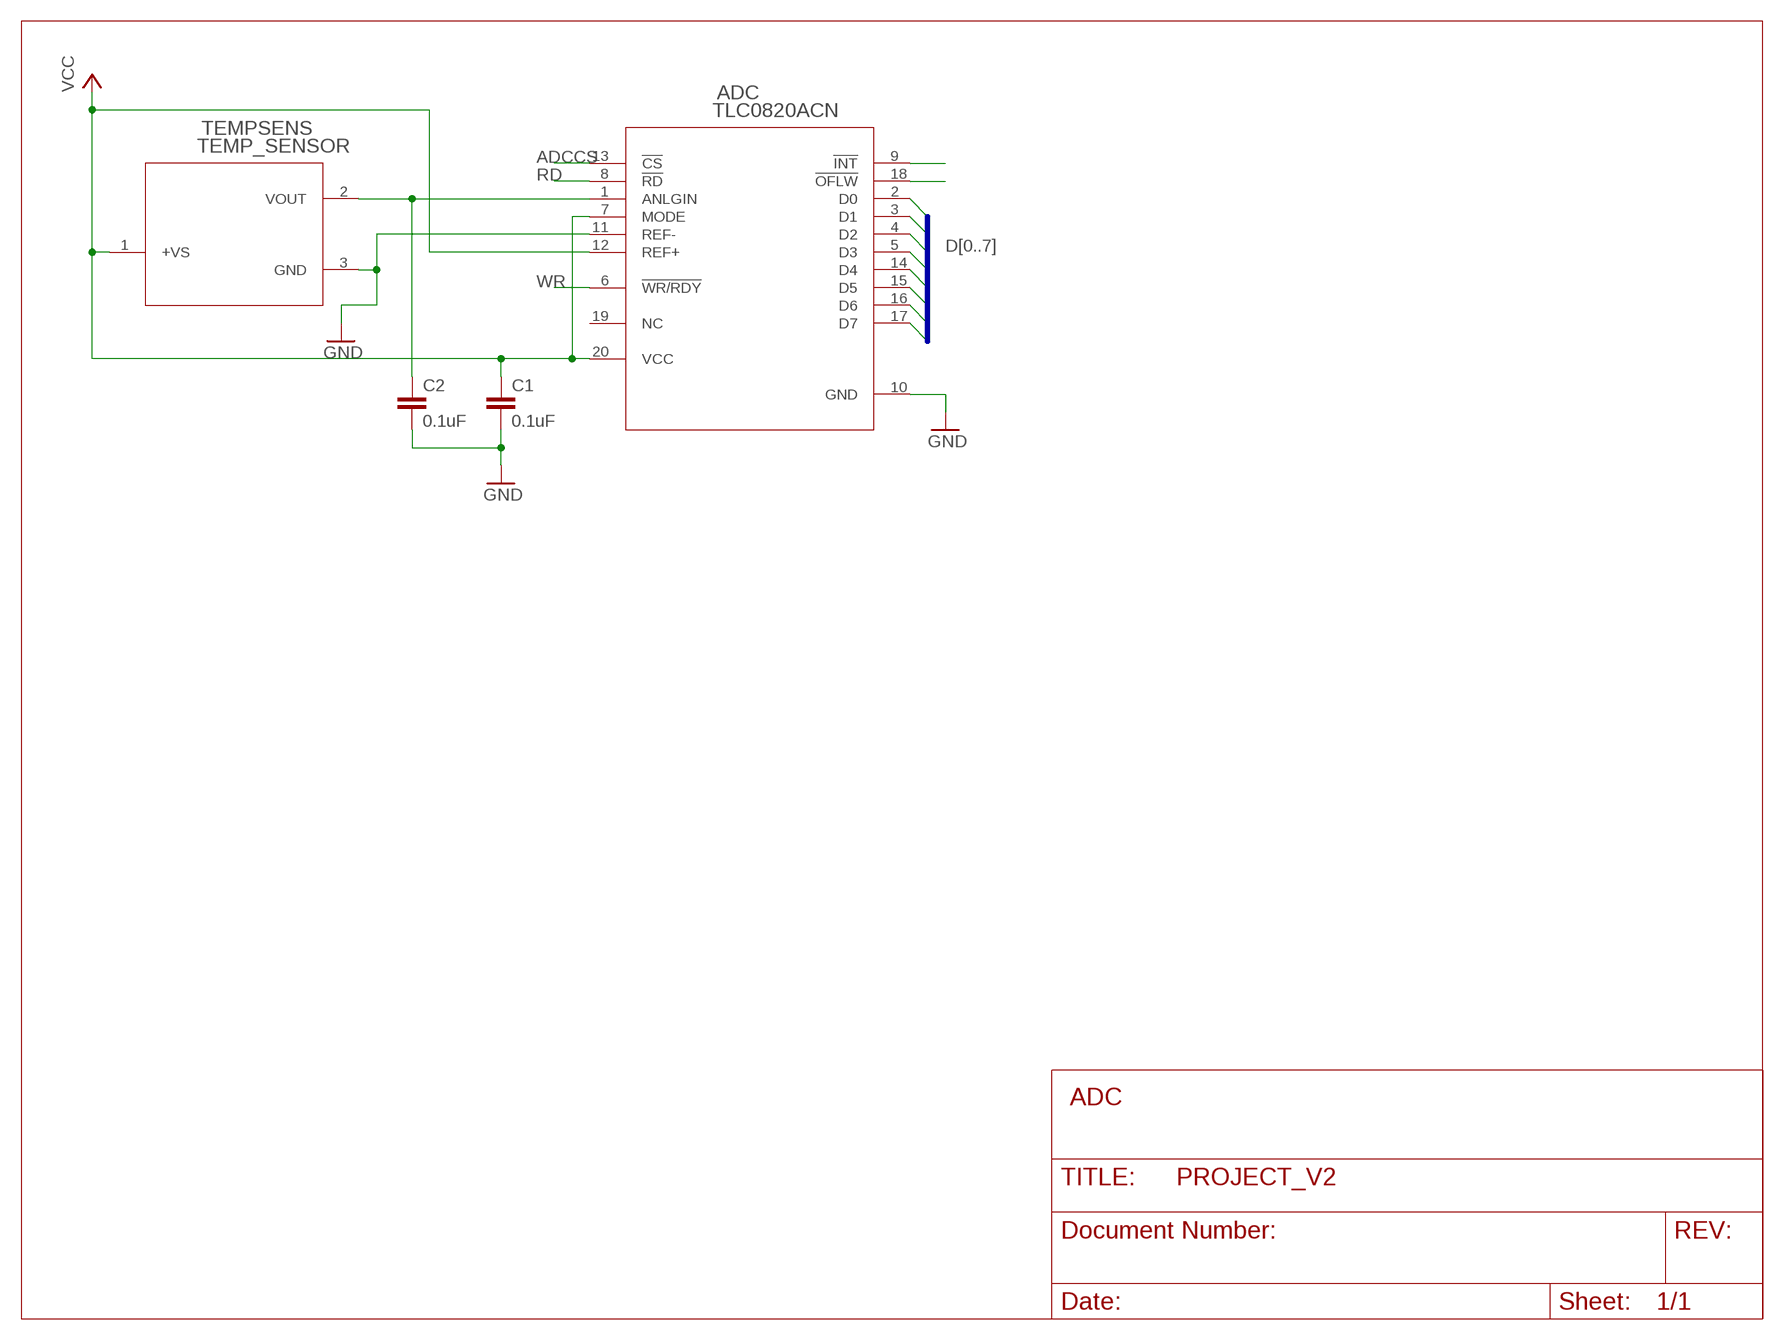
[diagram p8: schematic, module ADC, sheet 1]

### Parts
ADC  TLC0820ACN  ADC  [N20]
C1  0.1uF  0.1UF-KIT-EZ-50V-20%  [CAP-PTH-SMALL-KIT]
C2  0.1uF  0.1UF-KIT-EZ-50V-20%  [CAP-PTH-SMALL-KIT]
TEMPSENS  TEMP_SENSOR  [T_3]

### Nets
ADCCS: ADC.13(!CS)
D0: ADC.2(D0)
D1: ADC.3(D1)
D2: ADC.4(D2)
D3: ADC.5(D3)
D4: ADC.14(D4)
D5: ADC.15(D5)
D6: ADC.16(D6)
D7: ADC.17(D7)
GND: ADC.10(GND) ADC.11(REF-) C1.2 C2.2 TEMPSENS.3(GND)
N$26: ADC.1(ANLGIN) C2.1 TEMPSENS.2(VOUT)
N$27: ADC.9(!INT)
N$28: ADC.18(!OFLW)
RD: ADC.8(!RD)
VCC: ADC.7(MODE) ADC.12(REF+) ADC.20(VCC) C1.1 TEMPSENS.1(+VS)
WR: ADC.6(!WR/RDY)
Unconnected: ADC.19(NC)

### Buses
D[0..7]

### Notes on the sheet
- ADC

### Library data of the parts
ADC = Fuckboiz:ADC; MANUFACTURER_PART_NUMBER: TLC0820ACN; VENDOR: Texas Instruments
C1 C2 = Fuckboiz:0.1UF: 0.1µF ceramic capacitors A capacitor is a passive two-terminal electrical component used to store electrical energy temporarily in an electric field.; PROD_ID: CAP-08370
TEMPSENS = Fuckboiz:TEMP_SENSOR: Temperature Sensor TMP36GT9Z-ND Flat towards you -- left 1, middle 2, right 3 Jeremiah Ohlman; MANUFACTURER_PART_NUMBER: TMP36GT9Z; VENDOR: Analog Devices Inc

## Module MICROCONTROLLER
Ports: XTAL1(io) A[0..15](io) D[0..7](io) GND(pwr) VCC(pwr) RD(io) WR(io) PSEN(io) P3.5(io) PONE[0..7](io) ALE(io)
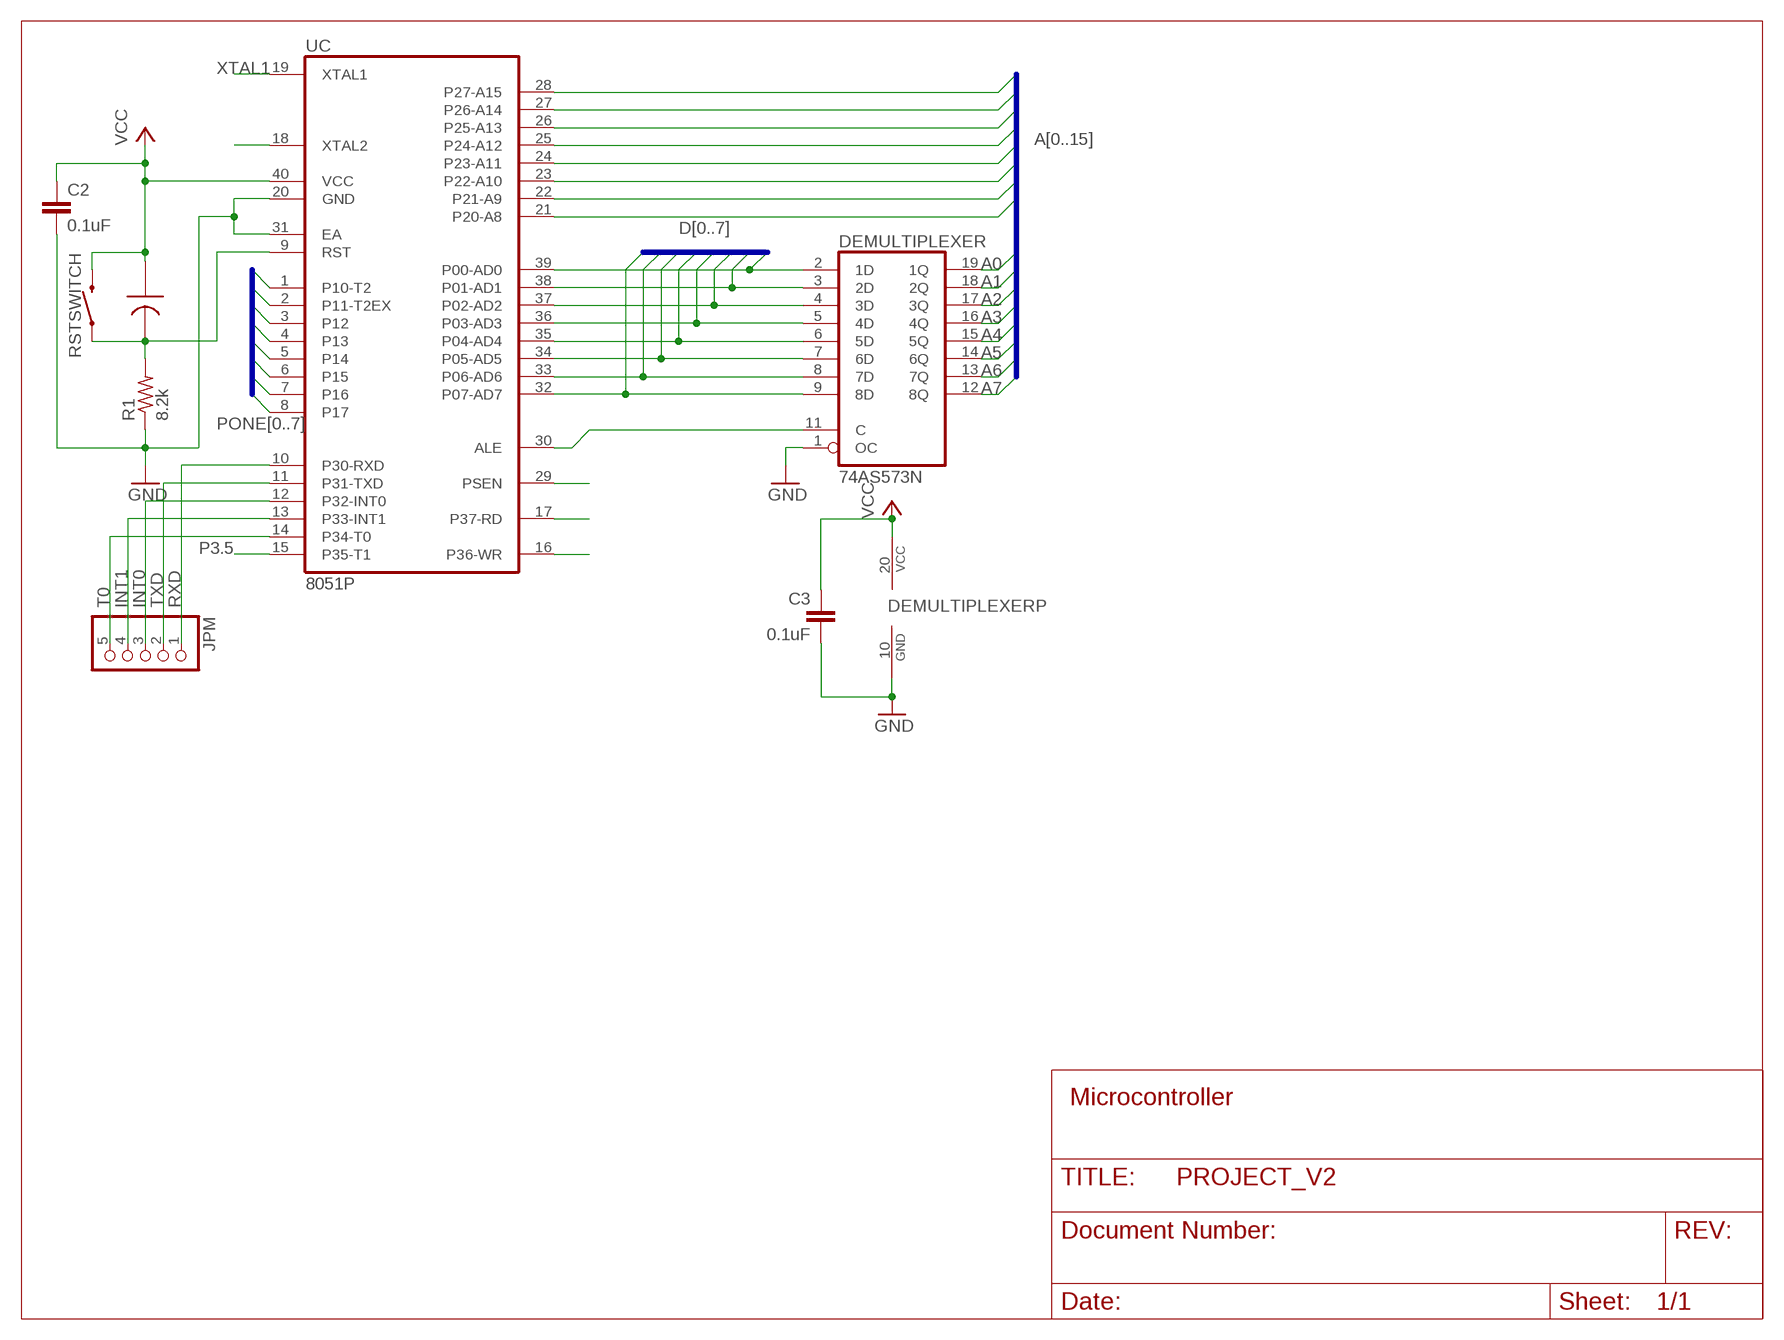
[diagram p9: schematic, module MICROCONTROLLER, sheet 1]

### Parts
C2  0.1uF  0.1UF-KIT-EZ-50V-20%  [CAP-PTH-SMALL-KIT]
C3  0.1uF  0.1UF-KIT-EZ-50V-20%  [CAP-PTH-SMALL-KIT]
DEMULTIPLEXER  74AS573N  [DIL20]
JPM  PINHD-1X5  [1X05]
R1  8.2k  R-US_0204/7  [0204/7]
RSTSWITCH  MOMENTARY-SWITCH-SPST-PTH-6.0MM  [TACTILE_SWITCH_PTH_6.0MM]
U$1  10UF  [POL_5MIL]
UC  8051P  [DIL40]

### Nets
A0: DEMULTIPLEXER.19(1Q)
A1: DEMULTIPLEXER.18(2Q)
A2: DEMULTIPLEXER.17(3Q)
A3: DEMULTIPLEXER.16(4Q)
A4: DEMULTIPLEXER.15(5Q)
A5: DEMULTIPLEXER.14(6Q)
A6: DEMULTIPLEXER.13(7Q)
A7: DEMULTIPLEXER.12(8Q)
A8: UC.21(P20-A8)
A9: UC.22(P21-A9)
A10: UC.23(P22-A10)
A11: UC.24(P23-A11)
A12: UC.25(P24-A12)
A13: UC.26(P25-A13)
A14: UC.27(P26-A14)
A15: UC.28(P27-A15)
ALE: DEMULTIPLEXER.11(C) UC.30(ALE)
D0: DEMULTIPLEXER.2(1D) UC.39(P00-AD0)
D1: DEMULTIPLEXER.3(2D) UC.38(P01-AD1)
D2: DEMULTIPLEXER.4(3D) UC.37(P02-AD2)
D3: DEMULTIPLEXER.5(4D) UC.36(P03-AD3)
D4: DEMULTIPLEXER.6(5D) UC.35(P04-AD4)
D5: DEMULTIPLEXER.7(6D) UC.34(P05-AD5)
D6: DEMULTIPLEXER.8(7D) UC.33(P06-AD6)
D7: DEMULTIPLEXER.9(8D) UC.32(P07-AD7)
GND: C2.2 C3.2 DEMULTIPLEXER.1(OC) DEMULTIPLEXER.10(GND) R1.1 UC.20(GND) UC.31(EA)
INT0: JPM.3 UC.12(P32-INT0)
INT1: JPM.4 UC.13(P33-INT1)
N$15: R1.2 RSTSWITCH.1 U$1.2(NEG) UC.9(RST)
N$31: UC.18(XTAL2)
P3.5: UC.15(P35-T1)
PONE0: UC.1(P10-T2)
PONE1: UC.2(P11-T2EX)
PONE2: UC.3(P12)
PONE3: UC.4(P13)
PONE4: UC.5(P14)
PONE5: UC.6(P15)
PONE6: UC.7(P16)
PONE7: UC.8(P17)
PSEN: UC.29(PSEN)
RD: UC.17(P37-RD)
RXD: JPM.1 UC.10(P30-RXD)
T0: JPM.5 UC.14(P34-T0)
TXD: JPM.2 UC.11(P31-TXD)
VCC: C2.1 C3.1 DEMULTIPLEXER.20(VCC) RSTSWITCH.3 U$1.1(POS) UC.40(VCC)
WR: UC.16(P36-WR)
XTAL1: UC.19(XTAL1)

### Buses
A[0..15]
D[0..7]
PONE[0..7]

### Notes on the sheet
- Microcontroller

### Library data of the parts
C2 C3 = Fuckboiz:0.1UF: 0.1µF ceramic capacitors A capacitor is a passive two-terminal electrical component used to store electrical energy temporarily in an electric field.; PROD_ID: CAP-08370
DEMULTIPLEXER = Fuckboiz:74*573: 8-bit D latch BUS DRIVER
JPM = pinhead:PINHD-1X5: PIN HEADER
R1 = rcl:R-US_: RESISTOR, American symbol; SPICEPREFIX: R
RSTSWITCH = SparkFun-Switches:MOMENTARY-SWITCH-SPST: Momentary Switch (Pushbutton) - SPST Normally-open (NO) SPST momentary switches (buttons, pushbuttons). Variants PTH-12MM - 12mm square, through-hole Momentary Pushbutton Switch - 12mm Square <https://www.sparkfun.com/products/9190> (COM-09190) PTH-6.0MM, PTH-6.0MM-KIT - 6.0mm square, through-hole Mini Pushbutton Switch <https://www.sparkfun.com/products/97> (COM-00097) KIT package intended for soldering kit's - only one side of pads' copper is exposed. PTH-RIGHT-ANGLE-KIT - Right-angle, through-hole Right Angle Tactile Button <https://www.sparkfun.com/products/10791> - Used on SparkFun BigTime Watch Kit <https://www.sparkfun.com/products/11734> SMD-12MM - 12mm square, surface-mount Tactile Button - SMD (12mm) <https://www.sparkfun.com/products/12993> (COM-12993) Used on SparkFun PicoBoard <https://www.sparkfun.com/products/11888> SMD-4.5MM - 4.5mm Square Trackball Switch Used on SparkFun Blackberry Trackballer Breakout <https://www.sparkfun.com/products/13169> SMD-4.6MMX2.8MM - 4.60mm x 2.80mm, surface mount Used on SparkFun SAMD21 Mini Breakout <https://www.sparkfun.com/products/13664> SMD-5.2MM, SMD-5.2-REDUNDANT - 5.2mm square, surface-mount Mini Pushbutton Switch - SMD <https://www.sparkfun.com/products/8720> (COM-08720) Used on Arduino Pro Mini <https://www.sparkfun.com/products/11114> REDUNDANT package connects both switch circuits together SMD-6.0X3.5MM - 6.0 x 3.5mm, surface mount Momentary Reset Switch SMD <https://www.sparkfun.com/products/8229> (COM-08229) SMD-6.2MM-TALL - 6.2mm square, surface mount Tactile Button - SMD (6mm) <https://www.sparkfun.com/products/12992> Used on SparkFun Digital Sandbox <https://www.sparkfun.com/products/12651> SMD-RIGHT-ANGLE - Right-angle, surface mount Used on SparkFun Block for Intel® Edison - Arduino <https://www.sparkfun.com/products/13036>; PROD_ID: SWCH-08441; SF_SKU: COM-00097
U$1 = Fuckboiz:10UF
UC = Fuckboiz:8051: (CHMOS) SINGLE-CHIP 8-BIT MICROCONTROLLER 80C31BH / 80C51 BH / 87C51 MCS 51 Source: http://apps.intel.com .. 27041907.pdf; OC_FARNELL: unknown; OC_NEWARK: unknown

## Module CHIPSELECT
Ports: A15(io) A14(io) A13(io) PSEN(io) P3.5(io) WR(io) RD(io) 7SEGCSWR(io) LCDCS(io) COLORCS(io) RTCCS(io) ADCCS(io) RAM2CS(io) RAM1CS(io) ROM2CS(io) ROM1CS(io) GND(pwr) VCC(pwr)
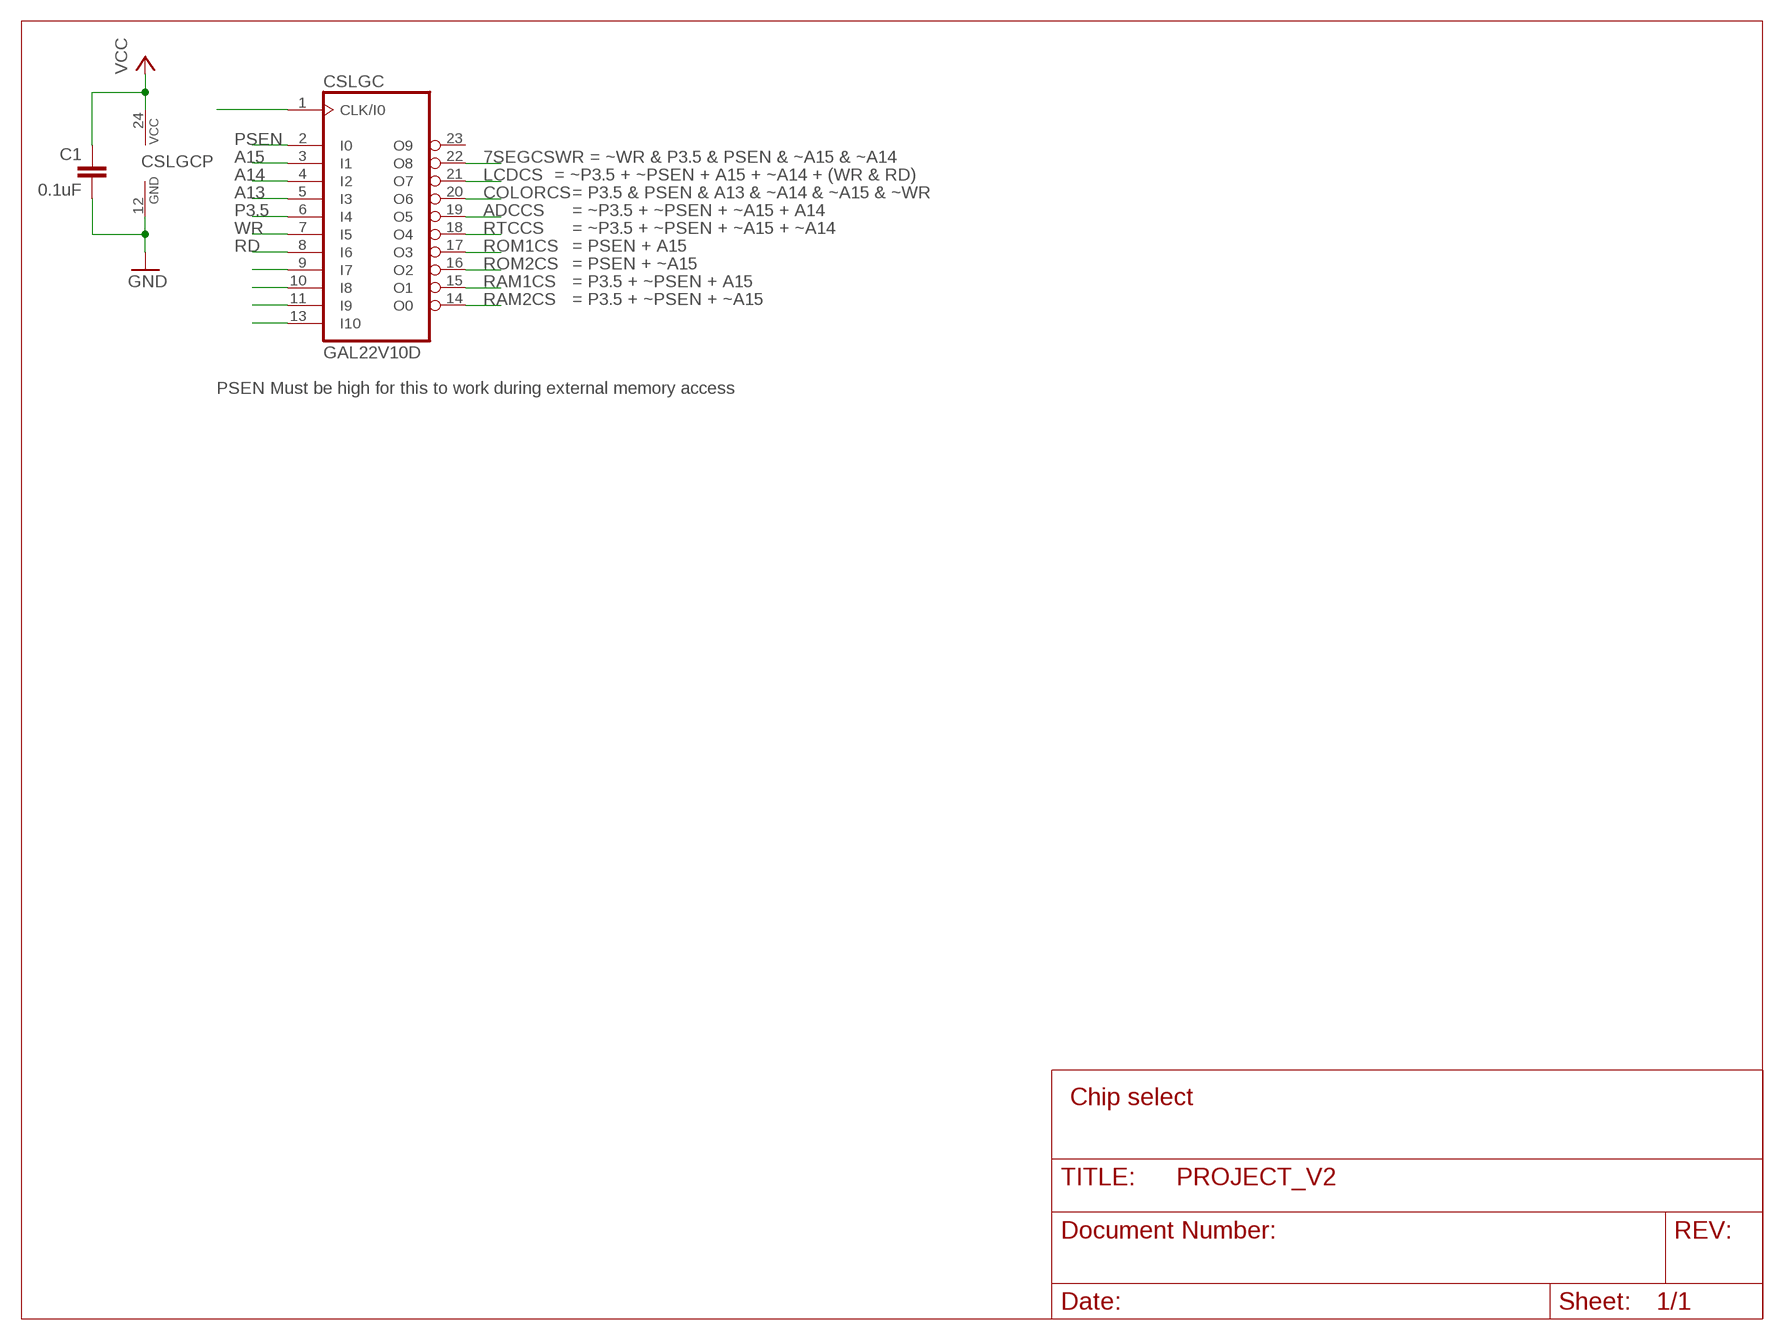
[diagram p10: schematic, module CHIPSELECT, sheet 1]

### Parts
C1  0.1uF  0.1UF-KIT-EZ-50V-20%  [CAP-PTH-SMALL-KIT]
CSLGC  GAL22V10D  22V10  [DIL24-3]

### Nets
7SEGCSWR: CSLGC.22(O8)
A13: CSLGC.5(I3)
A14: CSLGC.4(I2)
A15: CSLGC.3(I1)
ADCCS: CSLGC.19(O5)
COLORCS: CSLGC.20(O6)
GND: C1.2 CSLGC.12(GND)
LCDCS: CSLGC.21(O7)
N$1: CSLGC.9(I7)
N$2: CSLGC.10(I8)
N$3: CSLGC.11(I9)
N$4: CSLGC.13(I10)
N$35: CSLGC.1(CLK/I0)
P3.5: CSLGC.6(I4)
PSEN: CSLGC.2(I0)
RAM1CS: CSLGC.15(O1)
RAM2CS: CSLGC.14(O0)
RD: CSLGC.8(I6)
ROM1CS: CSLGC.17(O3)
ROM2CS: CSLGC.16(O2)
RTCCS: CSLGC.18(O4)
VCC: C1.1 CSLGC.24(VCC)
WR: CSLGC.7(I5)
Unconnected: CSLGC.23(O9)

### Notes on the sheet
- = ~WR & P3.5 & PSEN & ~A15 & ~A14
- = ~P3.5 + ~PSEN + A15 + ~A14 + (WR & RD)
- = P3.5 & PSEN & A13 & ~A14 & ~A15 & ~WR
- = ~P3.5 + ~PSEN + ~A15 + A14
- = ~P3.5 + ~PSEN + ~A15 + ~A14
- = PSEN + A15
- = PSEN + ~A15
- = P3.5 + ~PSEN + A15
- = P3.5 + ~PSEN + ~A15
- PSEN Must be high for this to work during external memory access
- Chip select

### Library data of the parts
C1 = Fuckboiz:0.1UF: 0.1µF ceramic capacitors A capacitor is a passive two-terminal electrical component used to store electrical energy temporarily in an electric field.; PROD_ID: CAP-08370
CSLGC = pal:22V10: PAL; MPN: GAL22V10D-7LPN; OC_FARNELL: 1571925; OC_NEWARK: 97M0480

## Module KEYPAD
Ports: PONE[0..7](io)
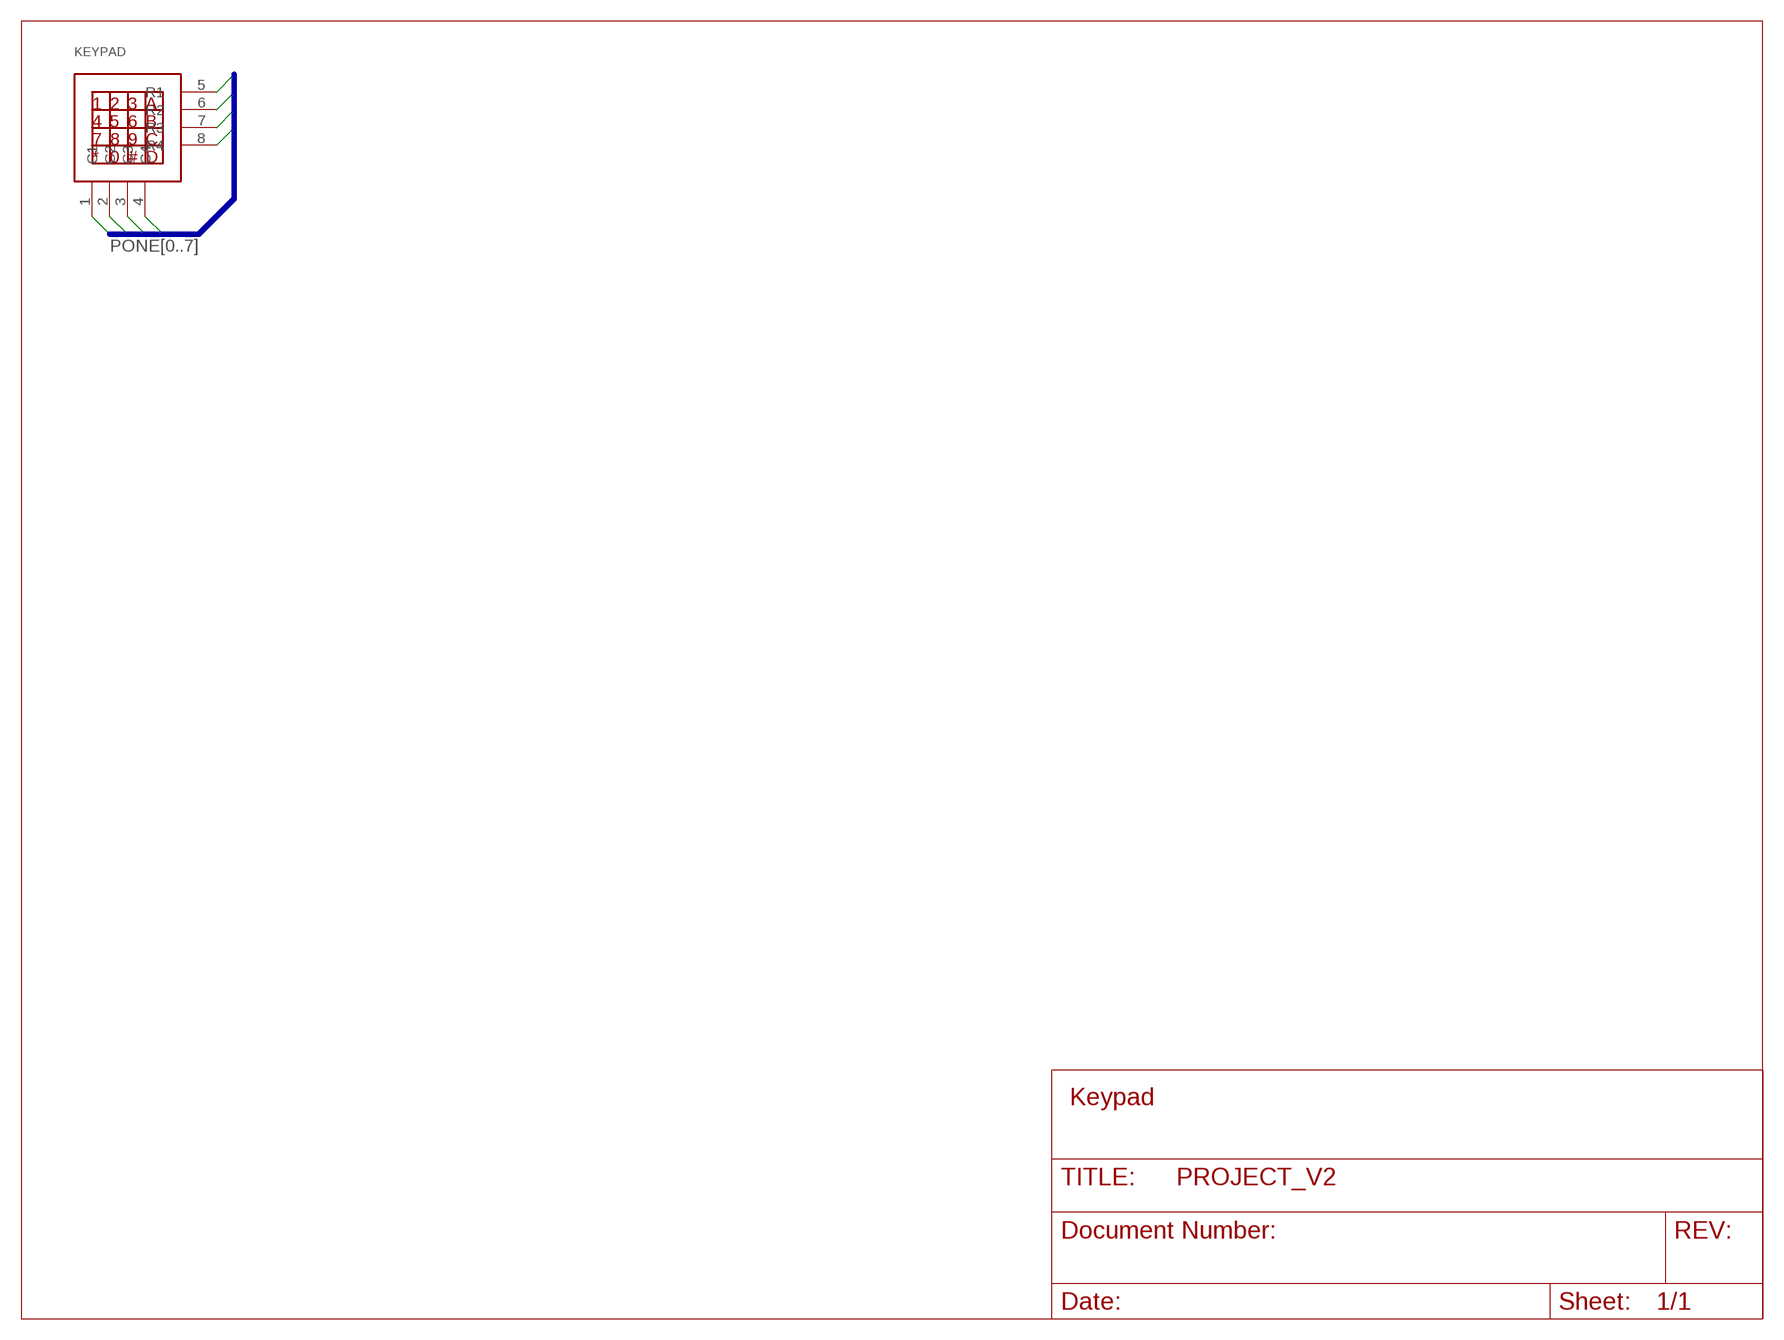
[diagram p11: schematic, module KEYPAD, sheet 1]

### Parts
KEYPAD  KEYPAD4X4  [KEYPAD4X4]

### Nets
PONE0: KEYPAD.1(C1)
PONE1: KEYPAD.2(C2)
PONE2: KEYPAD.3(C3)
PONE3: KEYPAD.4(C4)
PONE4: KEYPAD.5(R1)
PONE5: KEYPAD.6(R2)
PONE6: KEYPAD.7(R3)
PONE7: KEYPAD.8(R4)

### Buses
PONE[0..7]

### Notes on the sheet
- Keypad

### Library data of the parts
KEYPAD = Fuckboiz:KEYPAD4X4

## Net classes
0 default: clearance 0.205 mm